# EAGLE design kreme-iss (EAGLE 9.6.2)

## Sheet 1 of 4
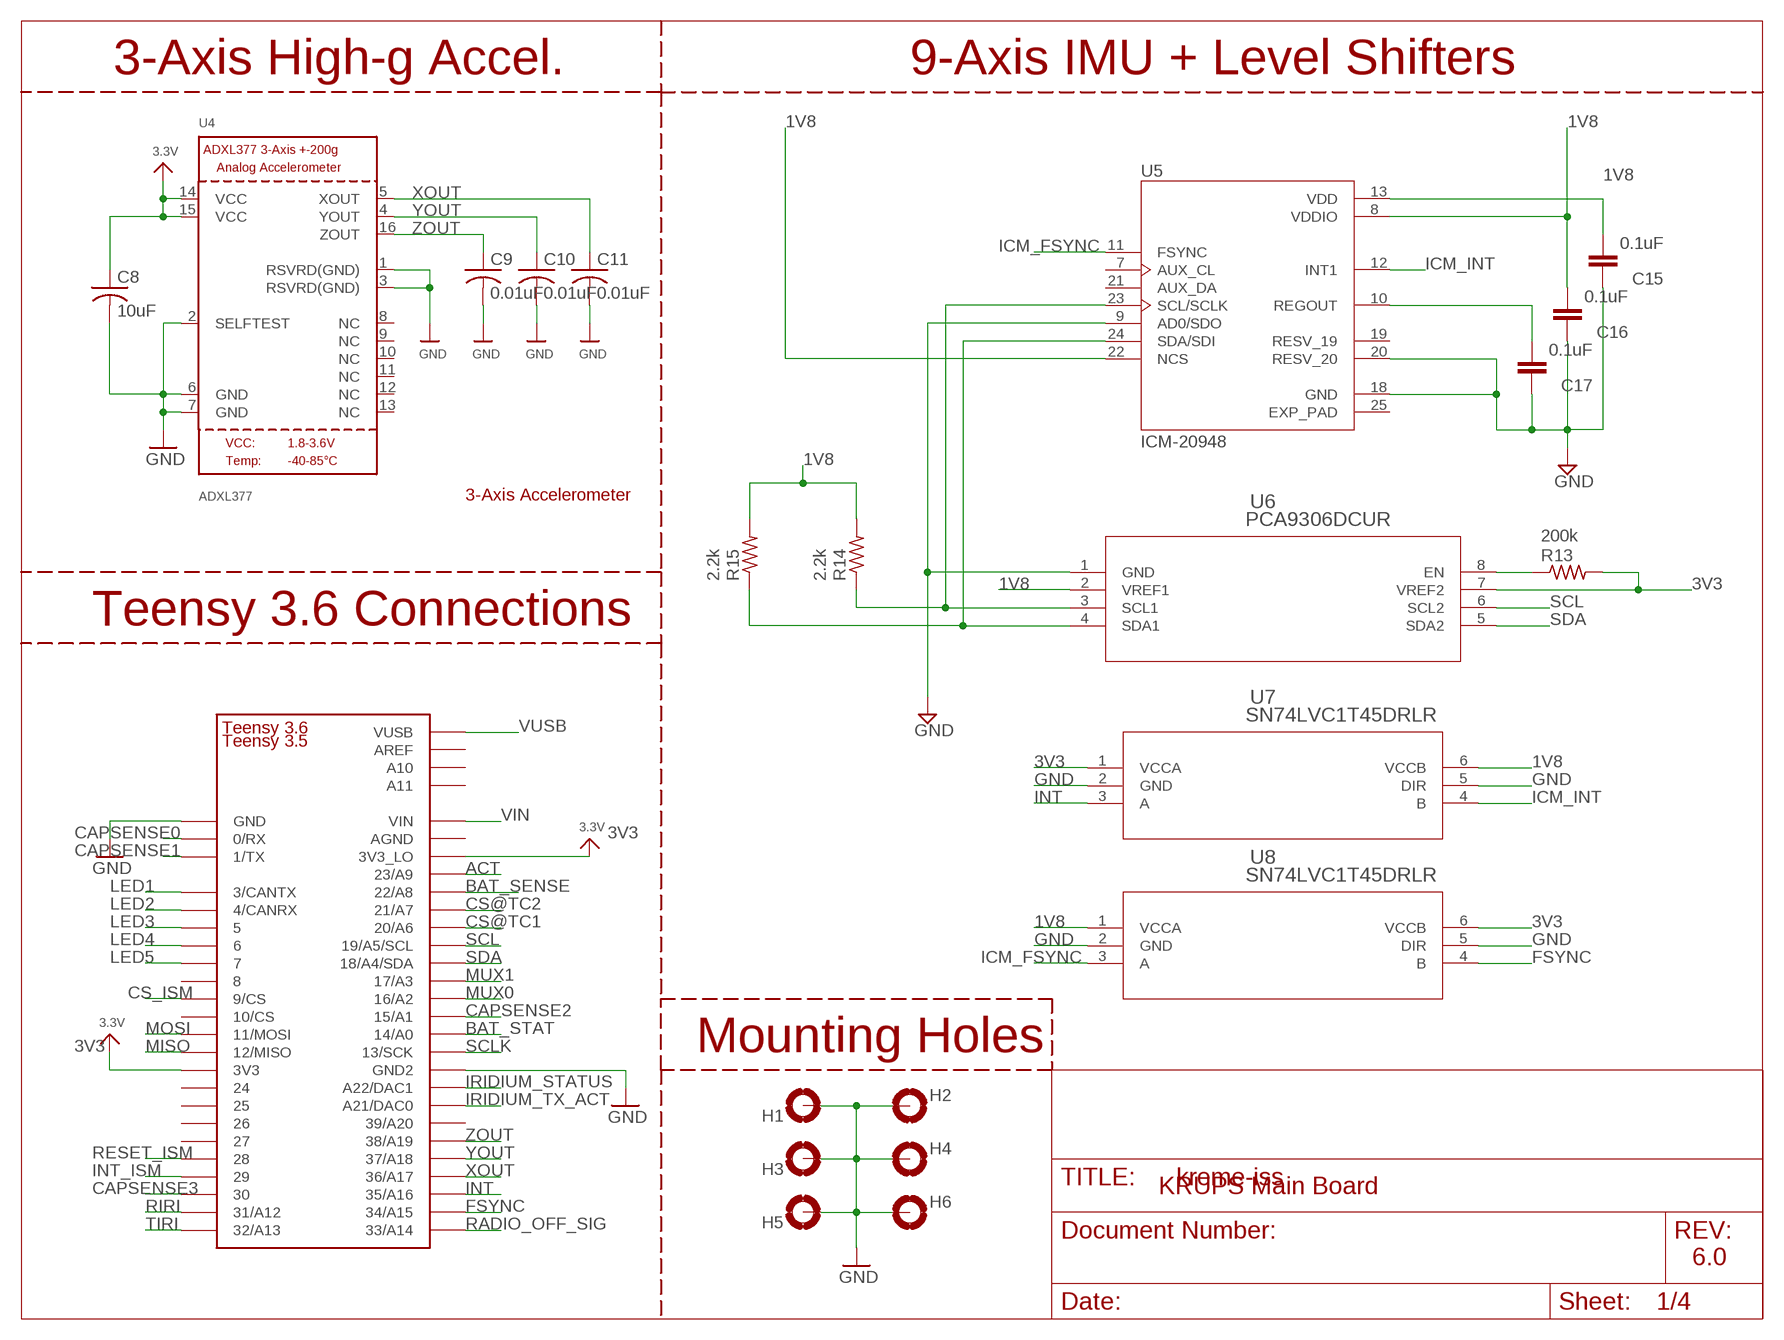
[diagram p0: schematic, sheet 1]

### Parts
C8  10uF  C-USC0603  [C0603]
C9  0.01uF  C-USC0603  [C0603]
C10  0.01uF  C-USC0603  [C0603]
C11  0.01uF  C-USC0603  [C0603]
C15  0.1uF  C-EUC0603  [C0603]
C16  0.1uF  C-EUC0603  [C0603]
C17  0.1uF  C-EUC0603  [C0603]
H1  MOUNT-PAD-ROUND2.8  [2,8-PAD]
H2  MOUNT-PAD-ROUND2.8  [2,8-PAD]
H3  MOUNT-PAD-ROUND2.8  [2,8-PAD]
H4  MOUNT-PAD-ROUND2.8  [2,8-PAD]
H5  MOUNT-PAD-ROUND2.8  [2,8-PAD]
H6  MOUNT-PAD-ROUND2.8  [2,8-PAD]
R13  200k  R-US_R0603  [R0603]
R14  2.2k  R-US_R0603  [R0603]
R15  2.2k  R-US_R0603  [R0603]
U4  ADXL377  ACCEL_ADXL377  [LFCSP16_LQ]
U5  ICM-20948  [QFN40P300X300X105-25N]
U6  PCA9306DCUR  [DCU8]
U7  SN74LVC1T45DRLR  [DRL6]
U8  SN74LVC1T45DRLR  [DRL6]
U$1  TEENSY_3.5/3.6_BASIC  [TEENSY_3.5/3.6_BASIC]

### Nets
1V8: C15.2 C16.2 R14.2 R15.2 U5.8(VDDIO) U5.13(VDD) U5.22(NCS) U6.2(VREF1) U7.6(VCCB) U8.1(VCCA) ; also sheet 3
3V3: C8.1 R13.2 U4.14(VCC) U4.15(VCC) U6.7(VREF2) U7.1(VCCA) U8.6(VCCB) U$1.3V3 U$1.3V3_LO ; supply symbol labelled 3.3V ; also sheet 2,3
ACT: U$1.23/A9 ; also sheet 3
BAT_SENSE: U$1.22/A8 ; also sheet 3
BAT_STAT: U$1.14/A0 ; also sheet 3
CAPSENSE0: U$1.0/RX ; also sheet 4
CAPSENSE1: U$1.1/TX ; also sheet 4
CAPSENSE2: U$1.15/A1 ; also sheet 4
CAPSENSE3: U$1.30 ; also sheet 4
CS@TC1: U$1.20/A6 ; also sheet 2
CS@TC2: U$1.21/A7 ; also sheet 2
CS_ISM: U$1.9/CS ; also sheet 4
FSYNC: U8.4(B) U$1.34/A15
GND: C8.2 C9.2 C10.2 C11.2 C15.1 C16.1 C17.1 H1.B2,8(MOUNT) H2.B2,8(MOUNT) H3.B2,8(MOUNT) H4.B2,8(MOUNT) H5.B2,8(MOUNT) H6.B2,8(MOUNT) U4.1(RSVRD(GND)) U4.2(SELFTEST) U4.3(RSVRD(GND)) U4.6(GND) U4.7(GND) U5.9(AD0/SDO) U5.18(GND) U5.20(RESV_20) U6.1(GND) U7.2(GND) U7.5(DIR) U8.2(GND) U8.5(DIR) U$1.GND ; also sheet 2,3,4
ICM_FSYNC: U5.11(FSYNC) U8.3(A)
ICM_INT: U5.12(INT1) U7.4(B)
INT: U7.3(A) U$1.35/A16
INT_ISM: U$1.29 ; also sheet 4
IRIDIUM_STATUS: U$1.A22/DAC1 ; also sheet 3
IRIDIUM_TX_ACT: U$1.21/DAC0(A21/DAC0) ; also sheet 3
LED1: U$1.3/CANTX ; also sheet 4
LED2: U$1.4/CANRX ; also sheet 4
LED3: U$1.5 ; also sheet 4
LED4: U$1.6 ; also sheet 4
LED5: U$1.7 ; also sheet 4
MISO: U$1.12/MISO ; also sheet 2,4
MOSI: U$1.11/MOSI ; also sheet 2,4
MUX0: U$1.16/A2 ; also sheet 2
MUX1: U$1.17/A3 ; also sheet 2
N$1: U$1.GND2 ; supply symbol labelled GND
N$13: R13.1 U6.8(EN)
N$15: C17.2 U5.10(REGOUT)
N$18: R14.1 U5.23(SCL/SCLK) U6.3(SCL1)
N$19: R15.1 U5.24(SDA/SDI) U6.4(SDA1)
RADIO_OFF_SIG: U$1.33/A14 ; also sheet 3
RESET_ISM: U$1.28 ; also sheet 4
RIRI: U$1.31/A12 ; also sheet 3
SCL: U6.6(SCL2) U$1.19/A5/SCL
SCLK: U$1.13/SCK ; also sheet 2,4
SDA: U6.5(SDA2) U$1.18/A4/SDA
TIRI: U$1.32/A13 ; also sheet 3
VIN: U$1.VIN ; also sheet 3
VUSB: U$1.VUSB ; also sheet 3
XOUT: C11.1 U4.5(XOUT) U$1.36/A17
YOUT: C10.1 U4.4(YOUT) U$1.37/A18
ZOUT: C9.1 U4.16(ZOUT) U$1.38/A19
Unconnected: U4.8(NC) U4.9(NC) U4.10(NC) U4.11(NC) U4.12(NC) U4.13(NC) U5.7(AUX_CL) U5.19(RESV_19) U5.21(AUX_DA) U$1.8 U$1.10/CS U$1.24 U$1.25 U$1.26 U$1.27 U$1.39/A20 U$1.A10 U$1.A11 U$1.AGND U$1.AREF

### Notes on the sheet
- 3-Axis High-g Accel. | 9-Axis IMU + Level Shifters
- 3-Axis Accelerometer
- Teensy 3.6 Connections
- Teensy 3.5
- Mounting Holes
- KRUPS Main Board
- 6.0

## Sheet 2 of 4
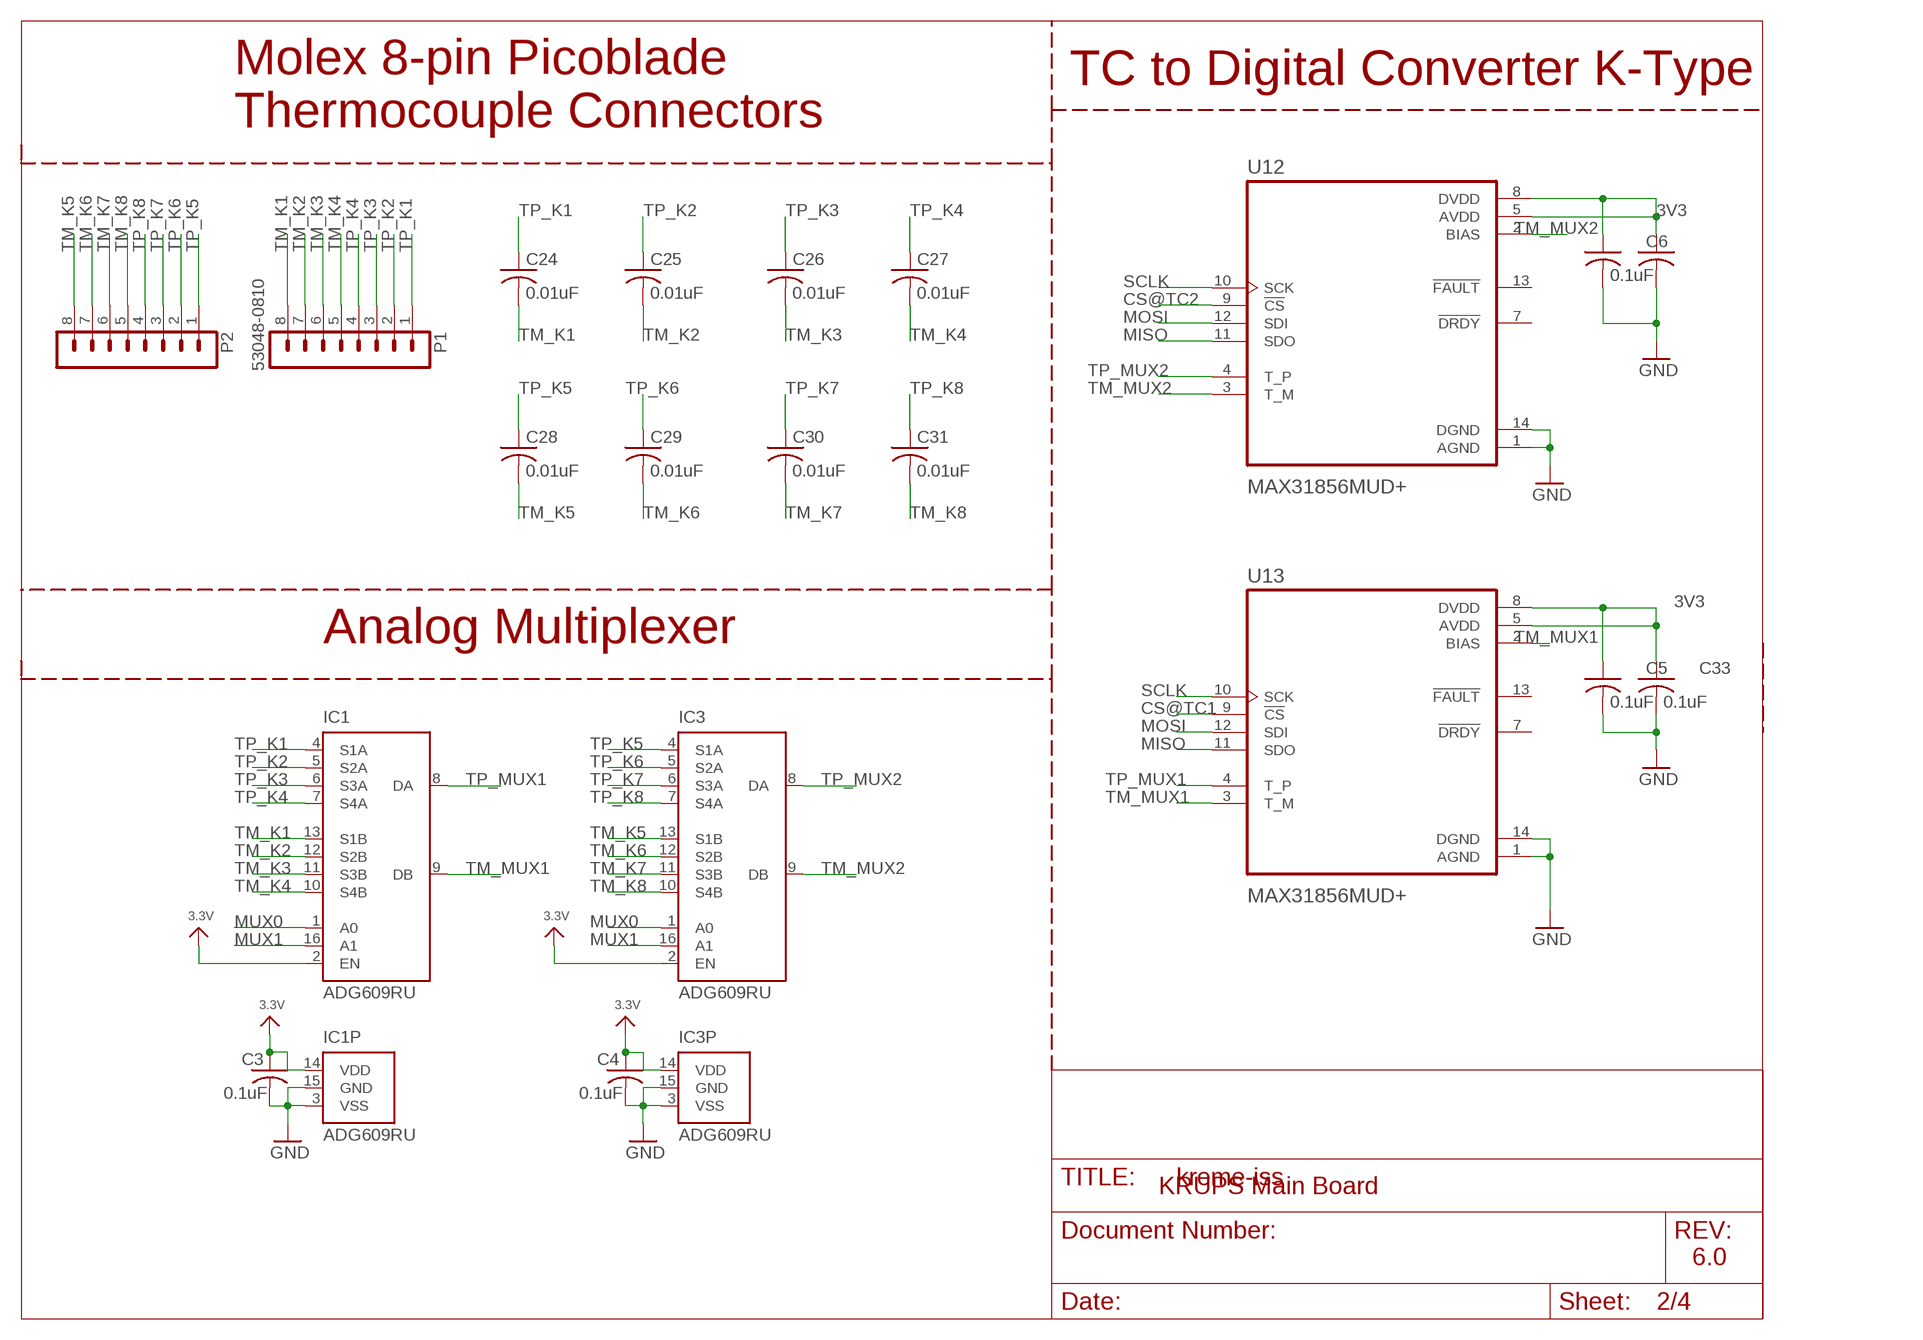
[diagram p1: schematic, sheet 2]

### Parts
C3  0.1uF  C-USC0603  [C0603]
C4  0.1uF  C-USC0603  [C0603]
C5  0.1uF  C-USC0603  [C0603]
C6  0.1uF  C-USC0603  [C0603]
C24  0.01uF  C-USC0603  [C0603]
C25  0.01uF  C-USC0603  [C0603]
C26  0.01uF  C-USC0603  [C0603]
C27  0.01uF  C-USC0603  [C0603]
C28  0.01uF  C-USC0603  [C0603]
C29  0.01uF  C-USC0603  [C0603]
C30  0.01uF  C-USC0603  [C0603]
C31  0.01uF  C-USC0603  [C0603]
C32  0.1uF  C-USC0603  [C0603]
C33  0.1uF  C-USC0603  [C0603]
IC1  ADG609RU  [TSSOP16]
IC3  ADG609RU  [TSSOP16]
P1  53048-0810  [53048-0810]
P2  53048-0810  [53048-0810]
U12  MAX31856MUD+  [SOP65P640X110-14N]
U13  MAX31856MUD+  [SOP65P640X110-14N]

### Nets
3V3: C3.1 C4.1 C5.1 C6.1 C32.1 C33.1 IC1.2(EN) IC1.14(VDD) IC3.2(EN) IC3.14(VDD) U12.5(AVDD) U12.8(DVDD) U13.5(AVDD) U13.8(DVDD) ; supply symbol labelled 3.3V ; also sheet 1,3
CS@TC1: U13.9(!CS) ; also sheet 1
CS@TC2: U12.9(!CS) ; also sheet 1
GND: C3.2 C4.2 C5.2 C6.2 C32.2 C33.2 IC1.3(VSS) IC1.15(GND) IC3.3(VSS) IC3.15(GND) U12.1(AGND) U12.14(DGND) U13.1(AGND) U13.14(DGND) ; also sheet 1,3,4
MISO: U12.11(SDO) U13.11(SDO) ; also sheet 1,4
MOSI: U12.12(SDI) U13.12(SDI) ; also sheet 1,4
MUX0: IC1.1(A0) IC3.1(A0) ; also sheet 1
MUX1: IC1.16(A1) IC3.16(A1) ; also sheet 1
SCLK: U12.10(SCK) U13.10(SCK) ; also sheet 1,4
TM_K1: C24.2 IC1.13(S1B) P1.8
TM_K2: C25.2 IC1.12(S2B) P1.7
TM_K3: C26.2 IC1.11(S3B) P1.6
TM_K4: C27.2 IC1.10(S4B) P1.5
TM_K5: C28.2 IC3.13(S1B) P2.8
TM_K6: C29.2 IC3.12(S2B) P2.7
TM_K7: C30.2 IC3.11(S3B) P2.6
TM_K8: C31.2 IC3.10(S4B) P2.5
TM_MUX1: IC1.9(DB) U13.2(BIAS) U13.3(T_M)
TM_MUX2: IC3.9(DB) U12.2(BIAS) U12.3(T_M)
TP_K1: C24.1 IC1.4(S1A) P1.1
TP_K2: C25.1 IC1.5(S2A) P1.2
TP_K3: C26.1 IC1.6(S3A) P1.3
TP_K4: C27.1 IC1.7(S4A) P1.4
TP_K5: C28.1 IC3.4(S1A) P2.1
TP_K6: C29.1 IC3.5(S2A) P2.2
TP_K7: C30.1 IC3.6(S3A) P2.3
TP_K8: C31.1 IC3.7(S4A) P2.4
TP_MUX1: IC1.8(DA) U13.4(T_P)
TP_MUX2: IC3.8(DA) U12.4(T_P)
Unconnected: U12.7(!DRDY) U12.13(!FAULT) U13.7(!DRDY) U13.13(!FAULT)

### Notes on the sheet
- TC to Digital Converter K-Type
- Molex 8-pin Picoblade
  Thermocouple Connectors
- Analog Multiplexer
- KRUPS Main Board
- 6.0

## Sheet 3 of 4
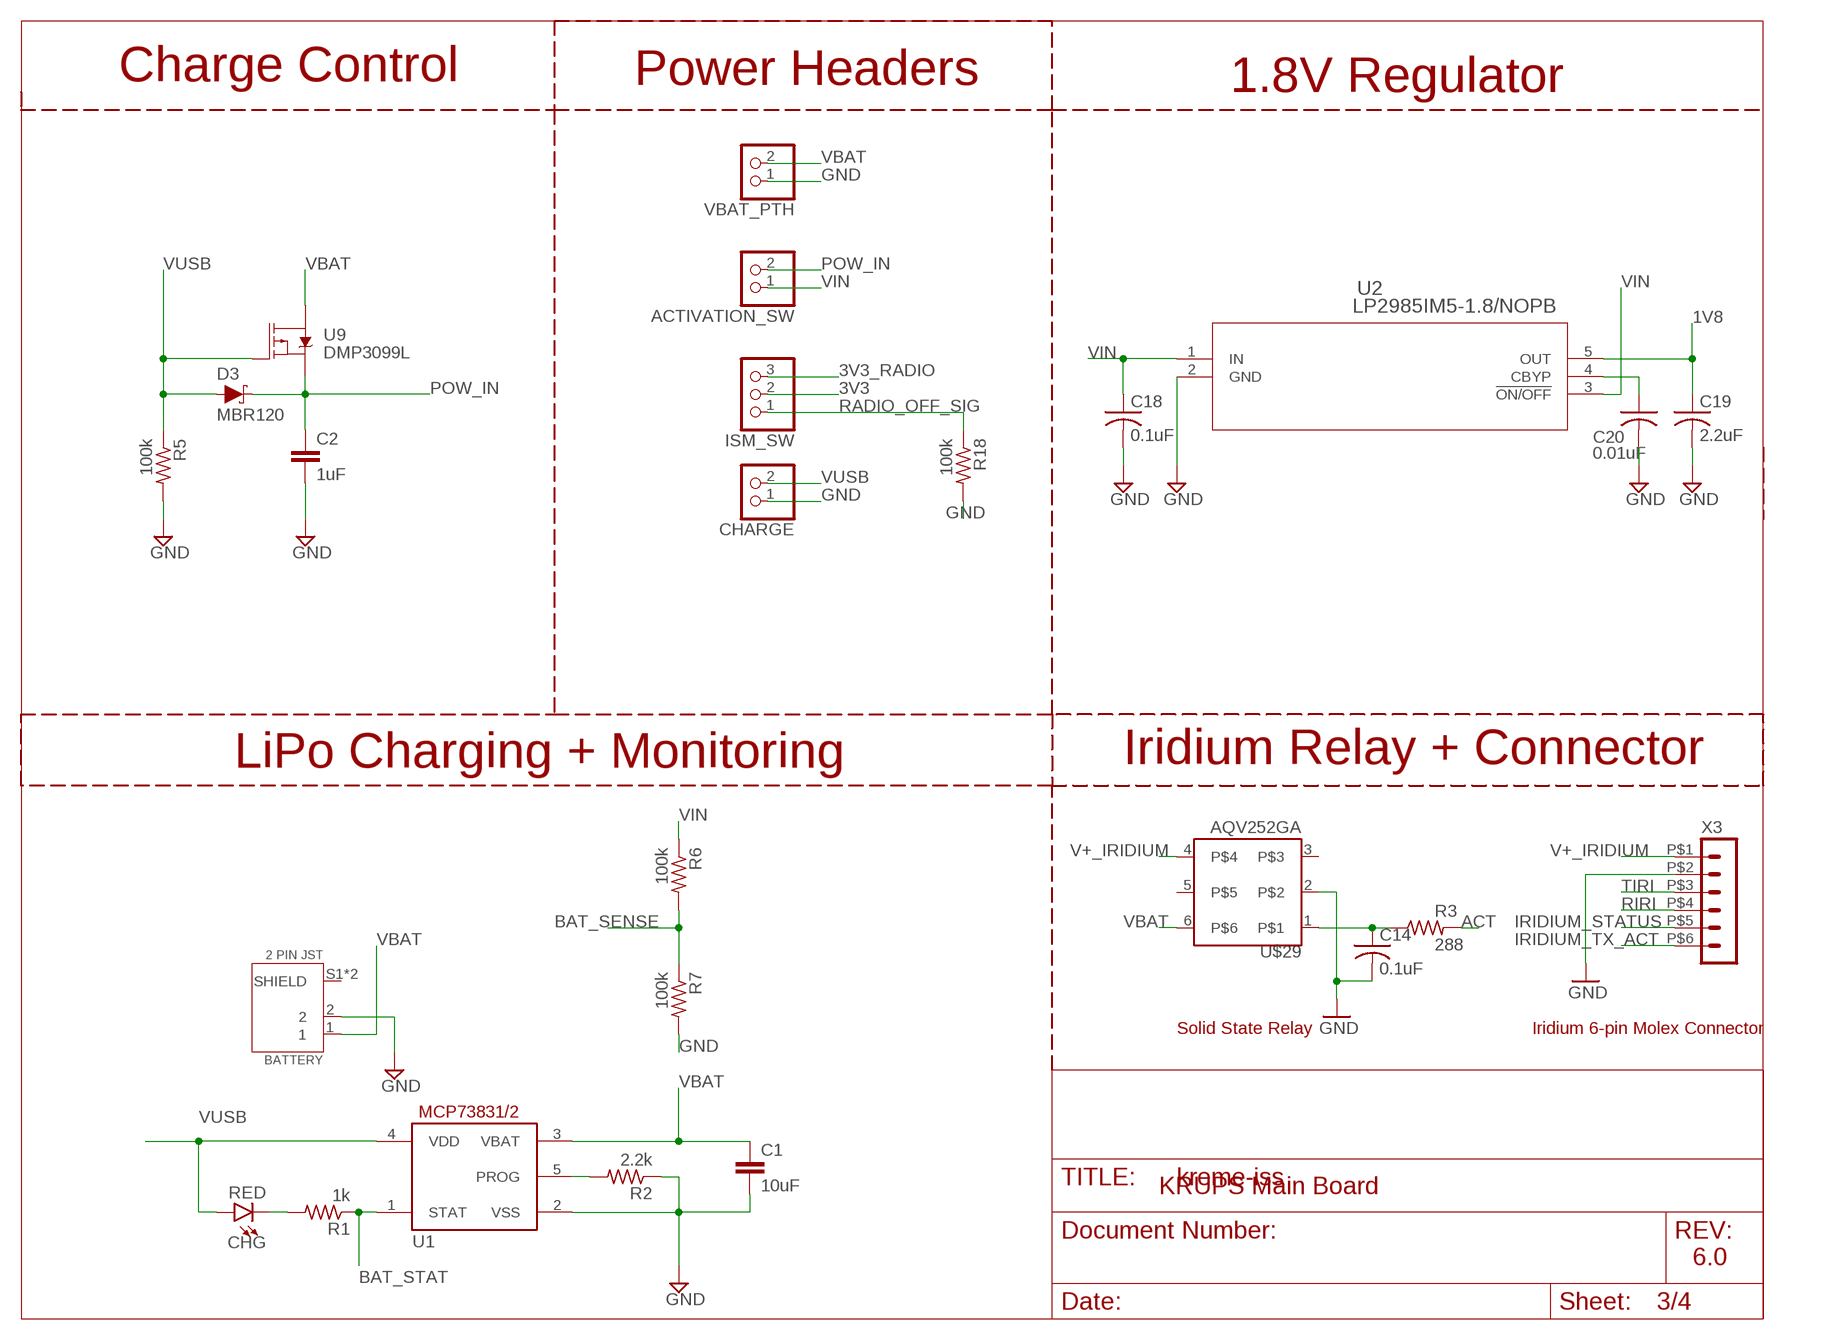
[diagram p2: schematic, sheet 3]

### Parts
ACTIVATION_SW  PINHD-1X2  [1X02]
BATTERY  2 PIN JST  S2B-PH-SM4-TB(LF)(SN)  [JST_S2B-PH-SM4-TB(LF)(SN)]
C1  10uF  C-EUC0603  [C0603]
C2  1uF  C-EUC0603  [C0603]
C14  0.1uF  C-USC0603  [C0603]
C18  0.1uF  C-USC0603  [C0603]
C19  2.2uF  C-USC0603  [C0603]
C20  0.01uF  C-USC0603  [C0603]
CHARGE  PINHD-1X2  [1X02]
CHG  RED  LED-RED0603  [LED-0603]
D3  MBR120  [SOD123FL]
ISM_SW  PINHD-1X3CB  [1X03-CLEANBIG]
R1  1k  R-US_R0603  [R0603]
R2  2.2k  R-US_R0603  [R0603]
R3  288  R-US_R0603  [R0603]
R5  100k  R-US_R0603  [R0603]
R6  100k  R-US_R0603  [R0603]
R7  100k  R-US_R0603  [R0603]
R18  100k  R-US_R0603  [R0603]
U1  MCP73831/OT  [SOT23-5L]
U2  LP2985IM5-1.8/NOPB  [MF05A]
U9  DMP3099L  [SOT23]
U$29  AQV252GA  [DIP6]
VBAT_PTH  PINHD-1X2  [1X02]
X3  HEADER_POS6_43650-0600  [43650-0600]

### Nets
1V8: C19.1 U2.5(OUT) ; also sheet 1
3V3: ISM_SW.2 ; also sheet 1,2
3V3_RADIO: ISM_SW.3 ; also sheet 4
ACT: R3.2 ; also sheet 1
BAT_SENSE: R6.2 R7.1 ; also sheet 1
BAT_STAT: R1.1 U1.1(STAT) ; also sheet 1
GND: BATTERY.2 C1.2 C2.2 C14.2 C18.2 C19.2 C20.2 CHARGE.1 R2.1 R5.2 R7.2 R18.2 U1.2(VSS) U2.2(GND) U$29.2 VBAT_PTH.1 X3.P$2 ; also sheet 1,2,4
IRIDIUM_STATUS: X3.P$5 ; also sheet 1
IRIDIUM_TX_ACT: X3.P$6 ; also sheet 1
N$4: R2.2 U1.5(PROG)
N$6: C14.1 R3.1 U$29.1
N$9: CHG.C R1.2
N$12: C20.1 U2.4(CBYP)
POW_IN: ACTIVATION_SW.2 C2.1 D3.C U9.2(S)
RADIO_OFF_SIG: ISM_SW.1 R18.1 ; also sheet 1
RIRI: X3.P$4 ; also sheet 1
TIRI: X3.P$3 ; also sheet 1
V+_IRIDIUM: U$29.4 X3.P$1
VBAT: BATTERY.1 C1.1 U1.3(VBAT) U9.3(D) U$29.6 VBAT_PTH.2
VIN: ACTIVATION_SW.1 C18.1 R6.1 U2.1(IN) U2.3(!ON/OFF) ; also sheet 1
VUSB: CHARGE.2 CHG.A D3.A R5.1 U1.4(VDD) U9.1(G) ; also sheet 1
Unconnected: BATTERY.S1(SHIELD) BATTERY.S2(SHIELD) U$29.3 U$29.5

### Notes on the sheet
- Charge Control | Power Headers | 1.8V Regulator
- LiPo Charging + Monitoring | Iridium Relay + Connector
- Solid State Relay | Iridium 6-pin Molex Connector
- KRUPS Main Board
- 6.0

## Sheet 4 of 4
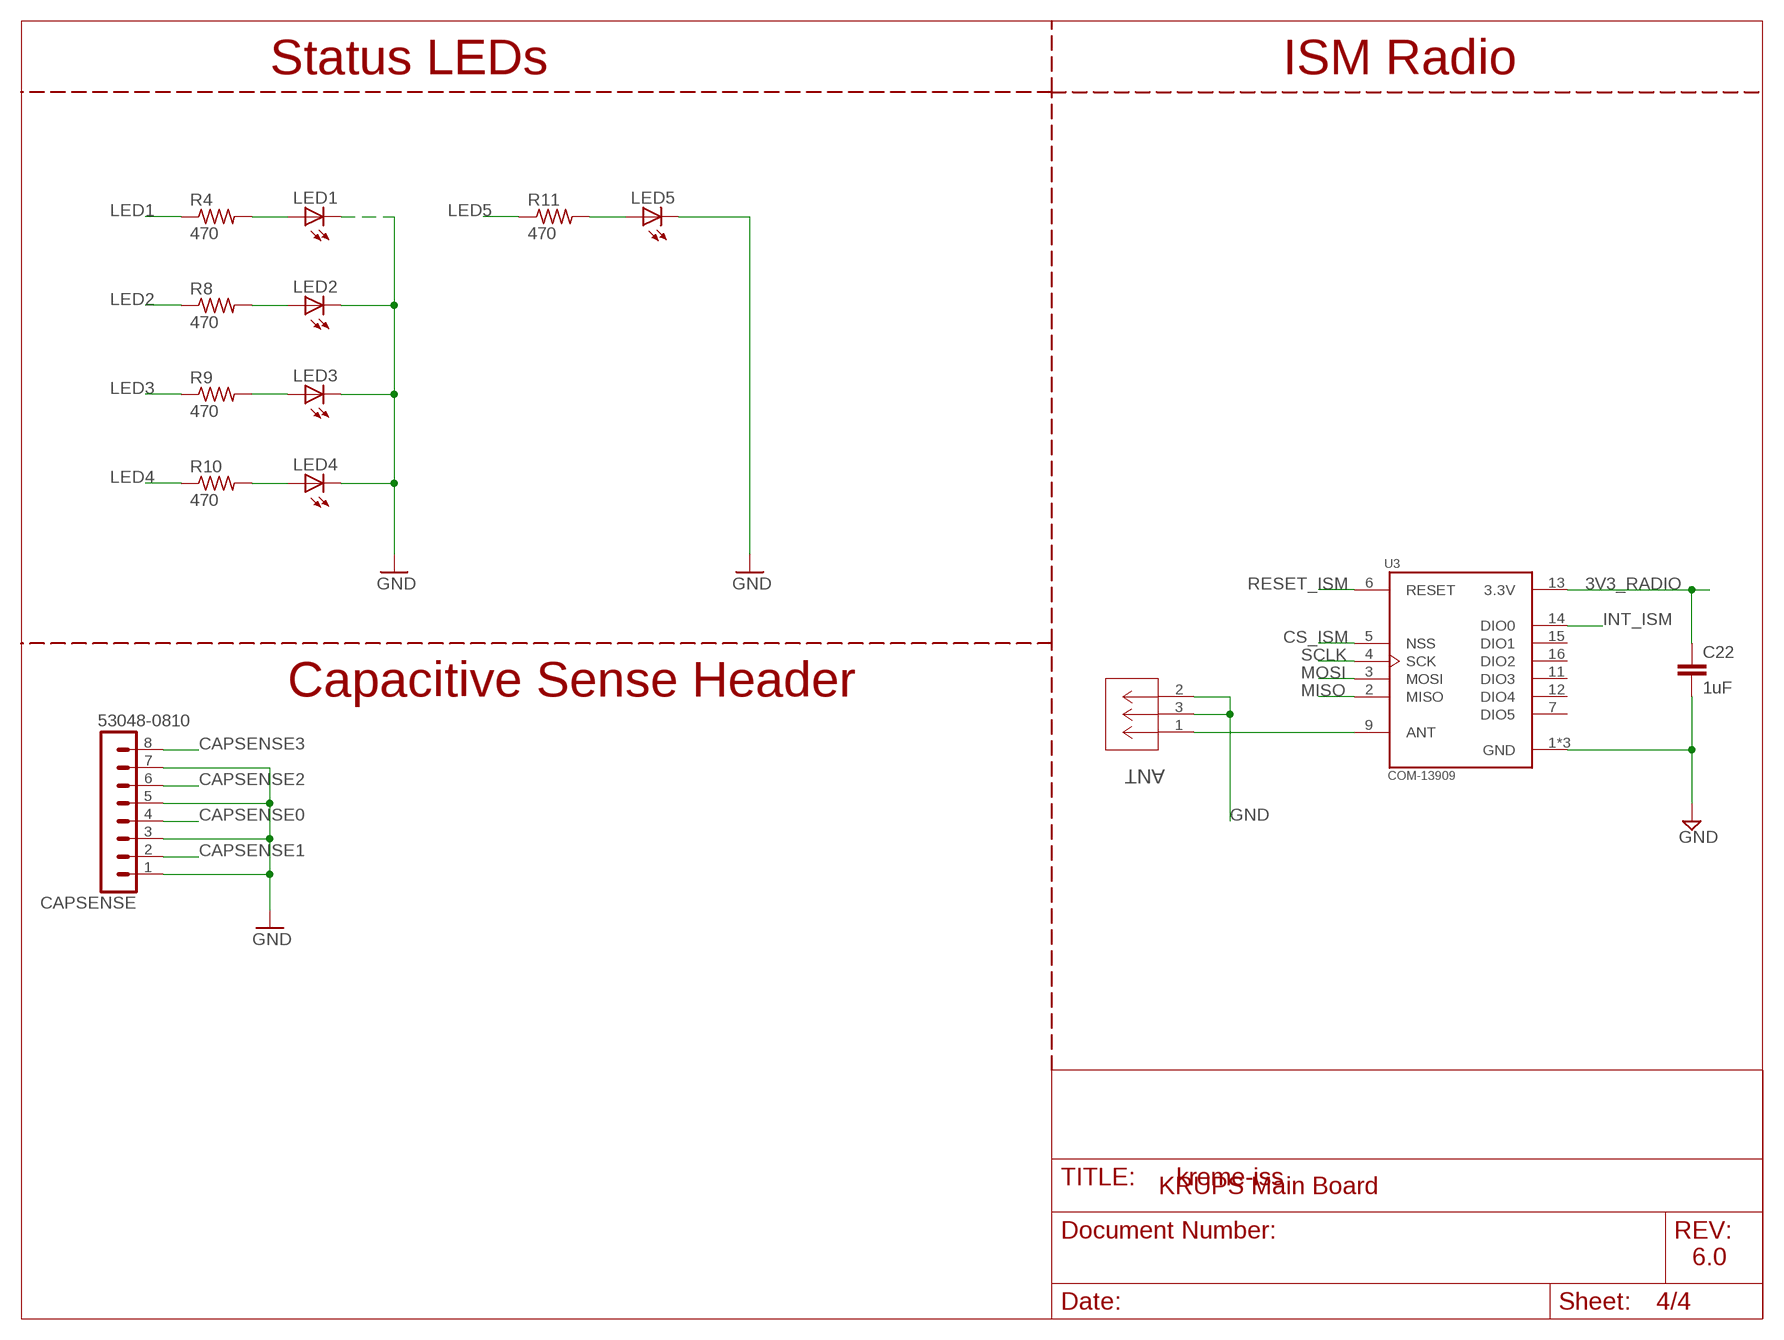
[diagram p3: schematic, sheet 4]

### Parts
ANT  U.FL-R-SMT-1(10)  [CONN_R-SMT-1(10)]
C22  1uF  C-EUC0603  [C0603]
CAPSENSE  53048-0810  [53048-0810]
LED1  LEDCHIP-LED0603  [CHIP-LED0603]
LED2  LEDCHIP-LED0603  [CHIP-LED0603]
LED3  LEDCHIP-LED0603  [CHIP-LED0603]
LED4  LEDCHIP-LED0603  [CHIP-LED0603]
LED5  LEDCHIP-LED0603  [CHIP-LED0603]
R4  470  R-US_R0603  [R0603]
R8  470  R-US_R0603  [R0603]
R9  470  R-US_R0603  [R0603]
R10  470  R-US_R0603  [R0603]
R11  470  R-US_R0603  [R0603]
U3  COM-13909  [MOD_COM-13909]

### Nets
3V3_RADIO: C22.1 U3.13(3.3V) ; also sheet 3
CAPSENSE0: CAPSENSE.4 ; also sheet 1
CAPSENSE1: CAPSENSE.2 ; also sheet 1
CAPSENSE2: CAPSENSE.6 ; also sheet 1
CAPSENSE3: CAPSENSE.8 ; also sheet 1
CS_ISM: U3.5(NSS) ; also sheet 1
GND: ANT.2 ANT.3 C22.2 CAPSENSE.1 CAPSENSE.3 CAPSENSE.5 CAPSENSE.7 LED1.C LED2.C LED3.C LED4.C LED5.C U3.1(GND) U3.8(GND) U3.10(GND) ; also sheet 1,2,3
INT_ISM: U3.14(DIO0) ; also sheet 1
LED1: R4.1 ; also sheet 1
LED2: R8.1 ; also sheet 1
LED3: R9.1 ; also sheet 1
LED4: R10.1 ; also sheet 1
LED5: R11.1 ; also sheet 1
MISO: U3.2(MISO) ; also sheet 1,2
MOSI: U3.3(MOSI) ; also sheet 1,2
N$3: ANT.1 U3.9(ANT)
N$20: LED1.A R4.2
N$21: LED2.A R8.2
N$22: LED3.A R9.2
N$23: LED4.A R10.2
N$28: LED5.A R11.2
RESET_ISM: U3.6(RESET) ; also sheet 1
SCLK: U3.4(SCK) ; also sheet 1,2
Unconnected: U3.7(DIO5) U3.11(DIO3) U3.12(DIO4) U3.15(DIO1) U3.16(DIO2)

### Notes on the sheet
- Status LEDs | ISM Radio
- Capacitive Sense Header
- KRUPS Main Board
- 6.0

## Power pins joined to a net without a drawn wire
EXP_PAD: U5.25(EXP_PAD)

## Library data of the parts
ACTIVATION_SW CHARGE VBAT_PTH = pinhead:PINHD-1X2: PIN HEADER
ANT = ufl:U.FL-R-SMT-1(10); BUILT_BY: EMA_Matt; COPYRIGHT: Copyright (C) 2018 Accelerated Designs. All rights reserved; MANUFACTURER_PART_NUMBER: U.FL-R-SMT-1(10); VENDOR: Hirose
BATTERY = S2B-PH-SM4-TB_LF__SN_:S2B-PH-SM4-TB(LF)(SN): PH Series 2 Position 2 mm Pitch Surface Mount Side Entry Shrouded Header; DESCRIPTION: PH Series 2 Position 2 mm Pitch Surface Mount Side Entry Shrouded Header; DIGI-KEY_PART_NUMBER: 455-1749-1-ND; DIGI-KEY_PURCHASE_URL: https://www.digikey.com/product-detail/en/jst-sales-america-inc/S2B-PH-SM4-TB_LF__SN_/455-1749-1-ND/926846?utm_source=snapeda&utm_medium=aggregator&utm_campaign=symbol; MF: JST Sales; MP: S2B-PH-SM4-TB_LF__SN_; PACKAGE: FakePackage u
C1 C2 C15-C17 C22 = rcl:C-EU: CAPACITOR, European symbol; SPICEPREFIX: C
C3-C6 C8-C11 C14 C24-C33 = adafruit:C-US: CAPACITOR, American symbol
C18-C20 = rcl:C-US: CAPACITOR, American symbol; SPICEPREFIX: C
CAPSENSE P1 P2 = con-molex-picoblade:53048-0810: HEADER
CHG = SparkFun-LED:LED-RED: Red SMD LED Used in manufacturing of most products at SparkFun Packages: 0603 - SMD 0603 package [Product Link] <http://docs.avagotech.com/docs/AV02-0551EN> 0603 SMART - SMD 0603 SMART package ( more efficient and expensive)[Product Link] <http://www.osram-os.com/Graphics/XPic2/00077099_0.pdf> 1206 - SMD1206 package [Product Link] <https://www.sparkfun.com/datasheets/DevTools/LilyPad/Q150OVS4.pdff> SparkFun Products: Pro Mini 328 -5V <https://www.sparkfun.com/products/821> RedBoard <https://www.sparkfun.com/products/12757> IOIO-OTG <https://www.sparkfun.com/products/13613>; PROD_ID: DIO-00819
D3 = gsynth:MBR120: Diode Schottky 20V 1A Surface Mount SOD-123FL
H1-H6 = holes:MOUNT-PAD-ROUND: MOUNTING PAD, round
IC1 IC3 = analog-devices:ADG609: 3 V/5 V, 4 Channel High Performance Analog Multiplexers Source: ADG608_609.pdf; MPN: ADG609BRUZ; OC_FARNELL: 1438945; OC_NEWARK: 19M8664
ISM_SW = adafruit:PINHD-1X3: PIN HEADER
LED1-LED5 = adafruit:LED: LED OSRAM: - CHIPLED LG R971, LG N971, LY N971, LG Q971, LY Q971, LO R971, LY R971 LH N974, LH R974 LS Q976, LO Q976, LY Q976 LO Q996 - Hyper CHIPLED LW Q18S LB Q993, LB Q99A, LB R99A - SideLED LS A670, LO A670, LY A670, LG A670, LP A670 LB A673, LV A673, LT A673, LW A673 LH A674 LY A675 LS A676, LA A676, LO A676, LY A676, LW A676 LS A679, LY A679, LG A679 - Hyper Micro SIDELED® LS Y876, LA Y876, LO Y876, LY Y876 LT Y87S - SmartLED LW L88C, LW L88S LB L89C, LB L89S, LG L890 LS L89K, LO L89K, LY L89K LS L896, LA L896, LO L896, LY L896 - TOPLED LS T670, LO T670, LY T670, LG T670, LP T670 LSG T670, LSP T670, LSY T670, LOP T670, LYG T670 LG T671, LOG T671, LSG T671 LB T673, LV T673, LT T673, LW T673 LH T674 LS T676, LA T676, LO T676, LY T676, LB T676, LH T676, LSB T676, LW T676 LB T67C, LV T67C, LT T67C, LS T67K, LO T67K, LY T67K, LW E67C LS E67B, LA E67B, LO E67B, LY E67B, LB E67C, LV E67C, LT E67C LW T67C LS T679, LY T679, LG T679 LS T770, LO T770, LY T770, LG T770, LP T770 LB T773, LV T773, LT T773, LW T773 LH T774 LS E675, LA E675, LY E675, LS T675 LS T776, LA T776, LO T776, LY T776, LB T776 LHGB T686 LT T68C, LB T68C - Hyper Mini TOPLED® LB M676 - Mini TOPLED Santana® LG M470 LS M47K, LO M47K, LY M47K Source: http://www.osram.convergy.de/
R1 R2 R4-R11 R13-R15 R18 = rcl:R-US_: RESISTOR, American symbol; SPICEPREFIX: R
R3 = adafruit:R-US_: RESISTOR, American symbol
U1 = adafruit:MCP73831: MCP73831/2 Miniature Single-Cell, Fully Integrated Li-Ion, Li-Polymer Charge Management Controllers. Nice and small simple lipoly charge controller, with adjustable current and status output (LED) http://www.ladyada.net/library/pcb/eaglelibrary.html
U2 = gsynth:LP2985IM5-1.8/NOPB; MANUFACTURER_PART_NUMBER: LP2985IM51.8NOPB; VENDOR: Texas Instruments
U3 = COM-13909:COM-13909: Rfm69hcw Wireless Transceiver 91; DESCRIPTION: General ISM < 1GHz Transceiver Module 915MHz Surface Mount; DIGI-KEY_PART_NUMBER: 1568-1394-ND; DIGI-KEY_PURCHASE_URL: https://www.digikey.com/product-detail/en/sparkfun-electronics/COM-13909/1568-1394-ND/6023504?utm_source=snapeda&utm_medium=aggregator&utm_campaign=symbol; MF: SparkFun Electronics; MP: COM-13909; PACKAGE: Module SparkFun Electronics
U4 = microbuilder:ACCEL_ADXL377: ADXL377 +/-200g 3-Axis Analog Accelerometer VCC: 1.8-3.6V
U5 = ICM-20948:ICM-20948: Axis=3 Axis Gyro+3 Axis Accel+Compass. Pin For Pin With m; DESCRIPTION: 9 Axis=3 Axis Gyro+3 Axis Accel+Compass. Pin For Pin With m; DIGI-KEY_PART_NUMBER: 1428-1123-1-ND; DIGI-KEY_PURCHASE_URL: https://www.digikey.com/product-detail/en/tdk-invensense/ICM-20948/1428-1123-1-ND/7062698?utm_source=snapeda&utm_medium=aggregator&utm_campaign=symbol; MF: TDK InvenSense; MP: ICM-20948; PACKAGE: QFN-24 InvenSense
U6 = gsynth:PCA9306DCUR; MANUFACTURER_PART_NUMBER: PCA9306DCUR; VENDOR: Texas Instruments
U7 U8 = gsynth:SN74LVC1T45DRLR; MANUFACTURER_PART_NUMBER: SN74LVC1T45DRLR; VENDOR: Texas Instruments
U9 = gsynth:DMP3099L: P-Channel 30V 3.8A (Ta) 1.08W (Ta) Surface Mount SOT-23
U12 U13 = MAX31856:MAX31856MUD+: None; DESCRIPTION: IC CONV THERMOCOUPLE 14TSSOP; DIGI-KEY_PART_NUMBER: MAX31856MUD+TTR-ND; MF: Maxim Integrated; MP: MAX31856MUD+; PACKAGE: TSSOP-14 Maxim
U$1 = Teensy356:TEENSY_3.5/3.6_BASIC
U$29 = TI_radio:AQV252GA
X3 = con-molex-micro-fit-3_0:HEADER_POS6_?: Molex - Micro-Fit 3.0 Series connector, 3.00mm (0.118") pitch header, 6 positions.

## Board
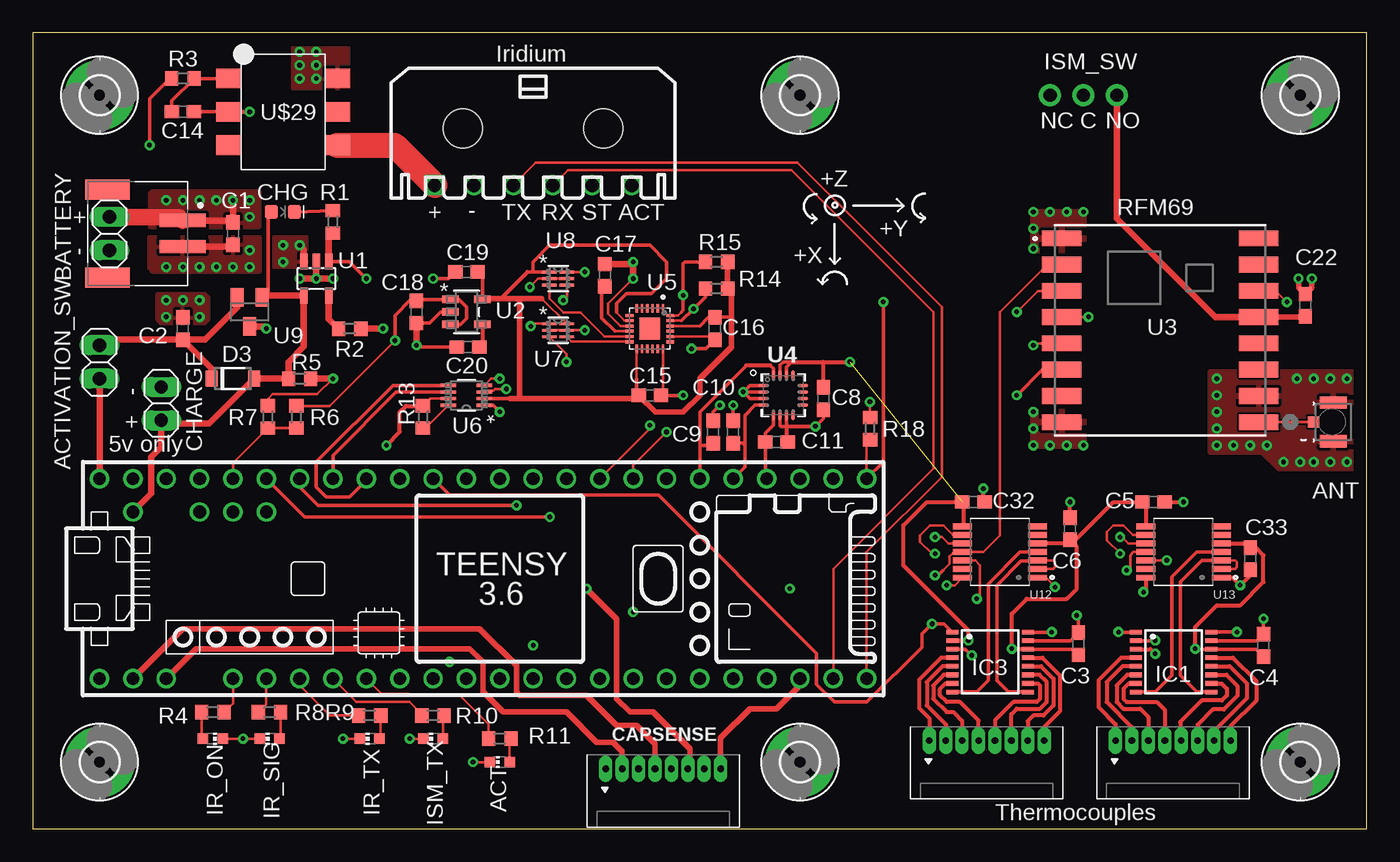
[diagram p4: board, top side]
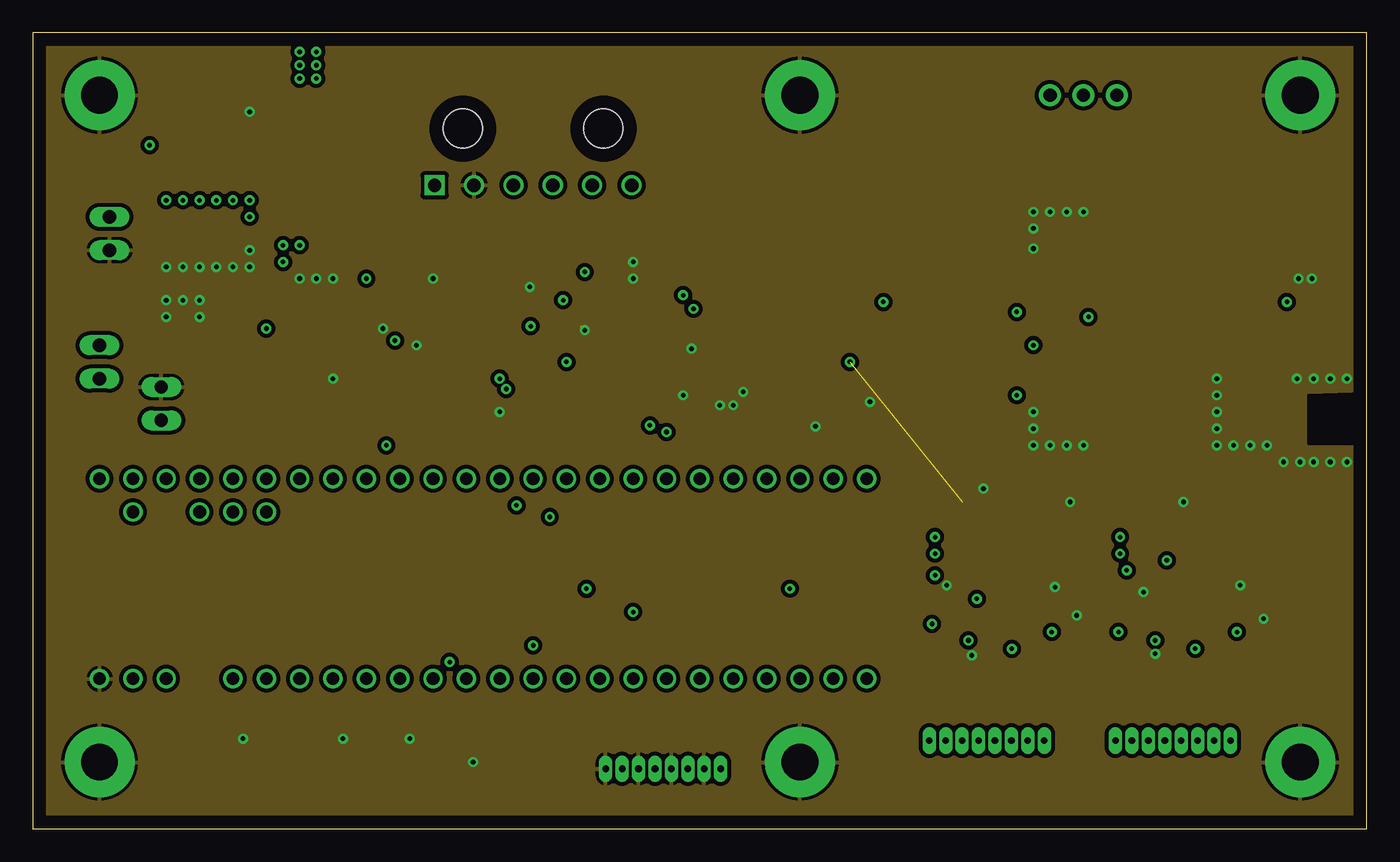
[diagram p5: board, inner layer Route2]
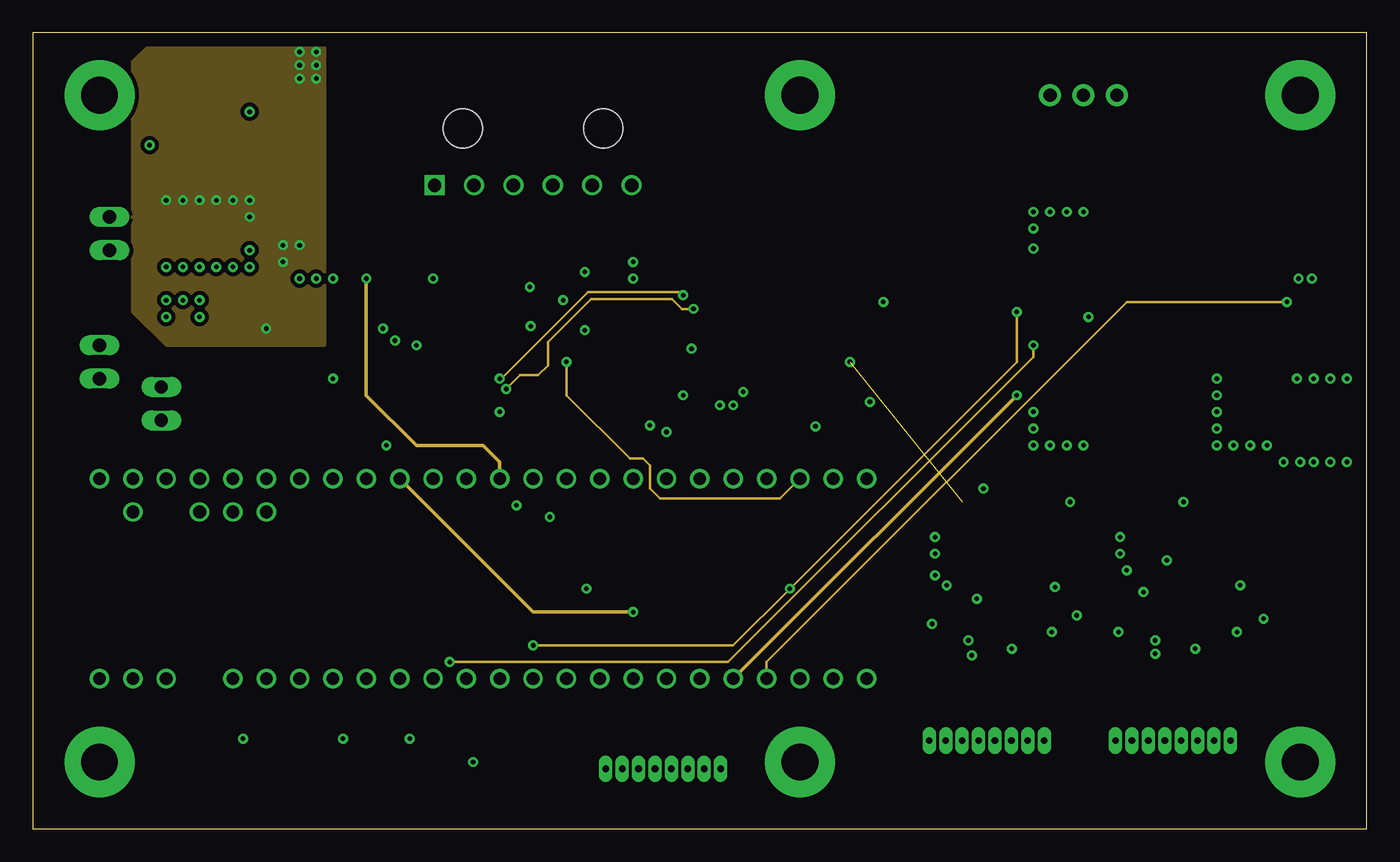
[diagram p6: board, inner layer Route15]
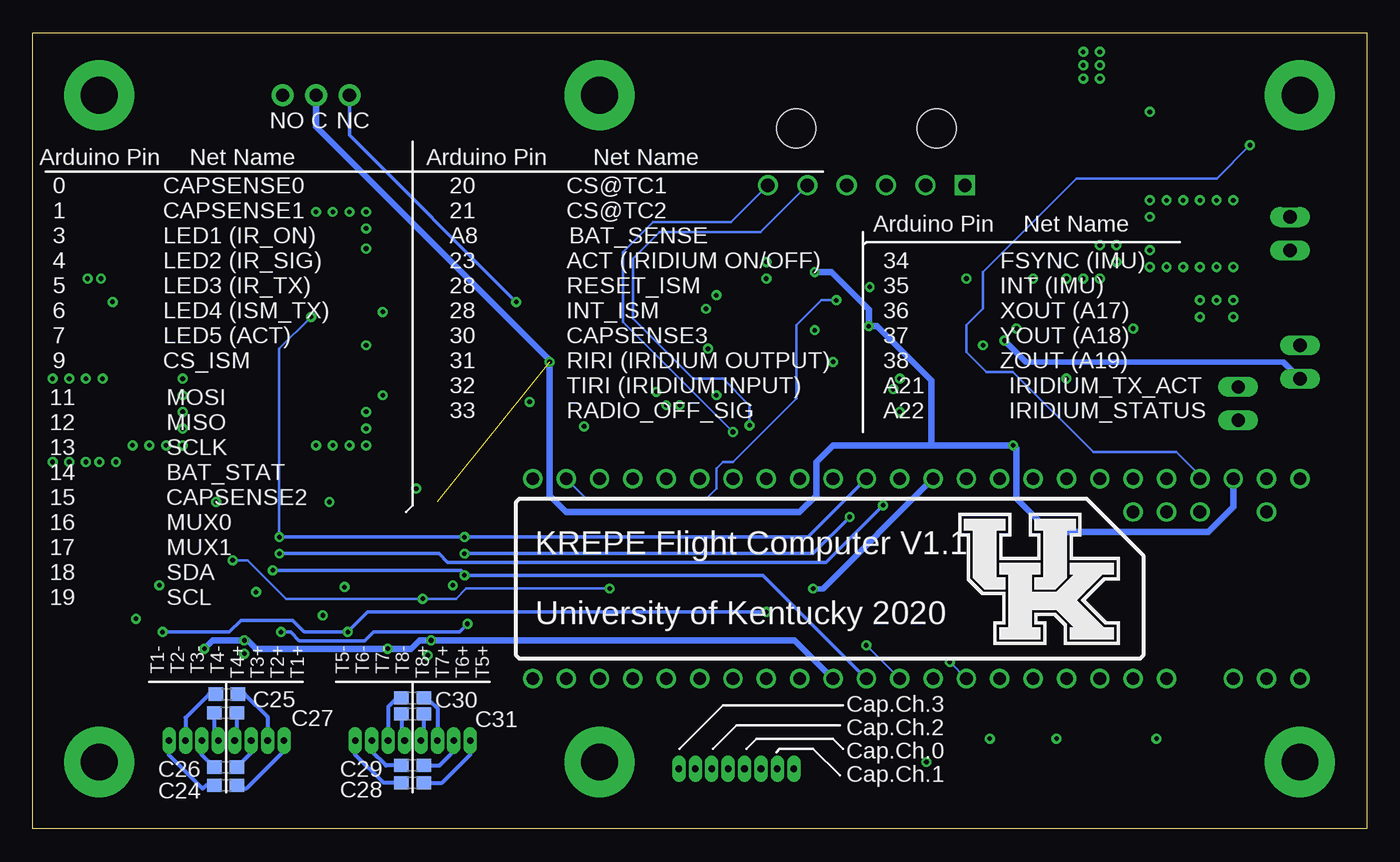
[diagram p7: board, bottom side, seen from below]

Size 101.58 x 60.63 mm. Coordinates in mm from the lower left corner, seen from the top.
Outline: 0,0 101.58,0 101.58,60.63 0,60.63 0,0
Copper layers (1+2*15+16): Top 0.035mm / dielectric 0.11mm / Route2 0.035mm / dielectric 1.13mm / Route15 0.035mm / dielectric 0.11mm / Bottom 0.035mm
Design rules "default *": minimum track width 6mil, minimum drill 0.35mm, track to track 6mil, track to pad 6mil, pad to pad 6mil, via to via 6mil, smd to smd 6mil, copper to edge 40mil, drill to drill 6mil, minimum pad ring 10mil, minimum via ring 8mil, stop-mask expansion 4mil, vias tented up to drill 14mil, thermal gap 10mil

### Footprints (pad centres in the part's own frame; a part is rotated, then mirrored left to right if it is on the bottom)
1X02 = drill 1.016 long: 1 -1.27,0; 2 1.27,0
CONN_R-SMT-1(10) = smd 0.838 x 0.889: 1 0,0 | smd 0.94 x 2.057: 2 -1.48,-1.505; 3 1.48,-1.505
JST_S2B-PH-SM4-TB(LF)(SN) = smd 1 x 3.5: 1 -1,0; 2 1,0 | smd 1.5 x 3.4: S1 -3.35,-5.75; S2 3.35,-5.75
C0603 = smd 1.1 x 1: 1 -0.85,0; 2 0.85,0
53048-0810 = drill 0.508 long: 1 -4.375,0; 2 -3.125,0; 3 -1.875,0; 4 -0.625,0; 5 0.625,0; 6 1.875,0; 7 3.125,0; 8 4.375,0
LED-0603 = smd 1 x 1: A -0.877,0; C 0.877,0
SOD123FL = smd 0.91 x 1.22: A 1.625,0; C -1.625,0
2,8-PAD = drill 2.8 pad 5.334: B2,8 0,0
TSSOP16 = smd 0.9 x 0.35: 1 -2.875,2.275; 2 -2.875,1.625; 3 -2.875,0.975; 4 -2.875,0.325; 5 -2.875,-0.325; 6 -2.875,-0.975; 7 -2.875,-1.625; 8 -2.875,-2.275; 9 2.875,-2.275; 10 2.875,-1.625; 11 2.875,-0.975; 12 2.875,-0.325; 13 2.875,0.325; 14 2.875,0.975; 15 2.875,1.625; 16 2.875,2.275
1X03-CLEANBIG = drill 1.016 pad 1.676: 1 -2.54,0; 2 0,0; 3 2.54,0
CHIP-LED0603 = smd 0.8 x 0.8: A 0,-0.75; C 0,0.75
R0603 = smd 1 x 1.1: 1 -0.85,0; 2 0.85,0
SOT23-5L = smd 0.55 x 1.2: 1 -0.95,-1.3; 2 0,-1.3; 3 0.95,-1.3; 4 0.95,1.3; 5 -0.95,1.3
MF05A = smd 1.27 x 0.559: 1 -1.219,0.953; 2 -1.219,0; 3 -1.219,-0.953; 4 1.219,-0.953; 5 1.219,0.953
MOD_COM-13909 = smd 3 x 1.2: 1 -7.5,7; 2 -7.5,5; 3 -7.5,3; 4 -7.5,1; 5 -7.5,-1; 6 -7.5,-3; 7 -7.5,-5; 8 -7.5,-7; 9 7.5,-7; 10 7.5,-5; 11 7.5,-3; 12 7.5,-1; 13 7.5,1; 14 7.5,3; 15 7.5,5; 16 7.5,7
LFCSP16_LQ = smd 0.8 x 0.25: 1 -1.5,0.75; 2 -1.5,0.25; 3 -1.5,-0.25; 4 -1.5,-0.75; 9 1.5,-0.75; 10 1.5,-0.25; 11 1.5,0.25; 12 1.5,0.75 | smd 0.25 x 0.8: 5 -0.75,-1.5; 6 -0.25,-1.5; 7 0.25,-1.5; 8 0.75,-1.5; 13 0.75,1.5; 14 0.25,1.5; 15 -0.25,1.5; 16 -0.75,1.5
QFN40P300X300X105-25N = smd 0.64 x 0.22: 1 -1.545,1; 2 -1.545,0.6; 3 -1.545,0.2; 4 -1.545,-0.2; 5 -1.545,-0.6; 6 -1.545,-1; 13 1.545,-1; 14 1.545,-0.6; 15 1.545,-0.2; 16 1.545,0.2; 17 1.545,0.6; 18 1.545,1 | smd 0.22 x 0.64: 7 -1,-1.545; 8 -0.6,-1.545; 9 -0.2,-1.545; 10 0.2,-1.545; 11 0.6,-1.545; 12 1,-1.545; 19 1,1.545; 20 0.6,1.545; 21 0.2,1.545; 22 -0.2,1.545; 23 -0.6,1.545; 24 -1,1.545 | smd 1.7 x 1.54: 25 0,0
DCU8 = smd 1.168 x 0.254: 1 -1.372,0.75; 2 -1.372,0.25; 3 -1.372,-0.25; 4 -1.372,-0.75; 5 1.372,-0.75; 6 1.372,-0.25; 7 1.372,0.25; 8 1.372,0.75
DRL6 = smd 1.092 x 0.203: 1 -0.66,0.5; 2 -0.66,0; 3 -0.66,-0.5; 4 0.66,-0.5; 5 0.66,0; 6 0.66,0.5
SOT23 = smd 1 x 1.4: 1 -0.95,-1.1; 2 0.95,-1.1; 3 0,1.1
SOP65P640X110-14N = smd 1.48 x 0.41: 1 -2.865,1.95; 2 -2.865,1.3; 3 -2.865,0.65; 4 -2.865,0; 5 -2.865,-0.65; 6 -2.865,-1.3; 7 -2.865,-1.95; 8 2.865,-1.95; 9 2.865,-1.3; 10 2.865,-0.65; 11 2.865,0; 12 2.865,0.65; 13 2.865,1.3; 14 2.865,1.95
TEENSY_3.5/3.6_BASIC = drill 0.965: 0/RX -25.4,-7.62; 1/TX -22.86,-7.62; 3/CANTX -17.78,-7.62; 3V3 7.62,-7.62; 3V3_LO -22.86,7.62; 4/CANRX -15.24,-7.62; 5 -12.7,-7.62; 6 -10.16,-7.62; 7 -7.62,-7.62; 8 -5.08,-7.62; 9/CS -2.54,-7.62; 10/CS 0,-7.62; 11/MOSI 2.54,-7.62; 12/MISO 5.08,-7.62; 13/SCK 5.08,7.62; 14/A0 2.54,7.62; 15/A1 0,7.62; 16/A2 -2.54,7.62; 17/A3 -5.08,7.62; 18/A4/SDA -7.62,7.62; 19/A5/SCL -10.16,7.62; 20/A6 -12.7,7.62; 21/A7 -15.24,7.62; 21/DAC0 12.7,7.62; 22/A8 -17.78,7.62; 23/A9 -20.32,7.62; 24 10.16,-7.62; 25 12.7,-7.62; 26 15.24,-7.62; 27 17.78,-7.62; 28 20.32,-7.62; 29 22.86,-7.62; 30 25.4,-7.62; 31/A12 27.94,-7.62; 32/A13 30.48,-7.62; 33/A14 30.48,7.62; 34/A15 27.94,7.62; 35/A16 25.4,7.62; 36/A17 22.86,7.62; 37/A18 20.32,7.62; 38/A19 17.78,7.62; 39/A20 15.24,7.62; A10 -17.78,5.08; A11 -15.24,5.08; A22/DAC1 10.16,7.62; AGND -25.4,7.62; AREF -20.32,5.08; GND -27.94,-7.62; GND2 7.62,7.62; VIN -27.94,7.62; VUSB -25.4,5.08
DIP6 = smd 1.9 x 1.5: 1 -4.15,2.54; 2 -4.15,0; 3 -4.15,-2.54; 4 4.15,-2.54; 5 4.15,0; 6 4.15,2.54
43650-0600 = drill 1.02 square: P$1 7.5,4.32 | drill 1.02: P$2 4.5,4.32; P$3 1.5,4.32; P$4 -1.5,4.32; P$5 -4.5,4.32; P$6 -7.5,4.32 | hole 3: 5.35,0; -5.35,0

### Placement (x,y rotation side)
ACTIVATION_SW  5.08,35.56 90 top
ANT  97.54,30.99 90 top
BATTERY  11.43,45.34 270 top
C1  15.24,45.34 270 top
C2  11.43,38.1 90 top
C3  79.63,14.1 90 top
C4  93.73,13.97 90 top
C5  85.34,24.89 0 top
C6  78.99,22.86 90 top
C8  60.2,32.77 270 top
C9  51.82,30.23 90 top
C10  53.34,30.23 90 top
C11  56.64,29.46 0 top
C14  11.43,54.61 0 top
C15  46.99,33.02 180 top
C16  51.94,38.1 90 top
C17  43.56,42.16 270 top
C18  29.21,39.37 270 top
C19  33.02,42.42 180 top
C20  33.15,36.7 180 top
C22  96.9,39.88 90 top
C24  86.89,3.31 180 bottom
C25  86.8,10.26 180 bottom
C26  86.9,4.7 180 bottom
C27  86.9,8.83 180 bottom
C28  72.66,3.51 180 bottom
C29  72.66,4.83 180 bottom
C30  72.66,9.96 180 bottom
C31  72.66,8.74 180 bottom
C32  71.63,24.89 0 top
C33  92.71,20.57 270 top
CAPSENSE  48.01,4.57 0 top
CHARGE  9.78,32.38 270 top
CHG  19.05,46.99 0 top
D3  15.24,34.29 0 top
H1  96.52,5.08 0 top
H2  58.42,5.08 0 top
H3  5.08,5.08 0 top
H4  58.42,55.88 0 top
H5  96.52,55.88 0 top
H6  5.08,55.88 0 top
IC1  86.87,12.7 0 top
IC3  72.9,12.7 0 top
ISM_SW  80.01,55.88 0 top
LED1  13.72,6.86 270 top
LED2  18.03,6.86 90 top
LED3  25.65,6.86 90 top
LED4  30.48,6.86 90 top
LED5  35.56,5.08 90 top
P1  86.83,6.73 0 top
P2  72.64,6.73 0 top
R1  22.86,46.23 90 top
R2  24.13,38.1 180 top
R3  11.43,57.15 180 top
R4  13.72,8.89 180 top
R5  20.32,34.29 0 top
R6  20.07,31.37 270 top
R7  17.91,31.37 90 top
R8  18.03,8.89 0 top
R9  25.65,8.64 0 top
R10  30.48,8.64 0 top
R11  35.56,6.86 0 top
R13  29.72,31.37 90 top
R14  52.07,41.15 0 top
R15  52.07,43.18 0 top
R18  63.75,30.48 90 top
U1  21.59,41.91 180 top
U2  33.02,39.37 0 top
U3  85.85,37.97 0 top
U4  57.15,33.02 0 top
U5  46.99,38.1 270 top
U6  33.02,33.02 180 top
U7  40.01,37.97 0 top
U8  40.01,41.91 0 top
U9  16.51,39.37 180 top
U12  73.66,21.08 180 top
U13  87.63,21.08 180 top
U$1  33.02,19.05 0 top
U$29  19.05,54.61 0 top
VBAT_PTH  5.84,45.34 90 top
X3  38.1,53.34 180 top

### Tracks (layer width: path | path; a pad name or v marks a point on that pad's centre or on a via)
1V8
  Top 0.203: 38.87,42.41 U8.1 | U5.13 45.99,34.29 | U5.22 50.8,38.3 | 38.75,40.39 U7.6 | 44.45,39.37 44.45,39.32 45.07,38.7 U5.8
  Top 0.254: C19.1 34.24,42.05 U2.5 34.3,40.39 | 45.99,34.29 45.99,33.17 | 45.99,33.17 C15.2 | 50.8,38.3 51.44,38.94 51.93,38.94 C16.2 51.98,38.99 53.21,38.99 | U6.2 36.33,32.77 36.34,32.77 | 45.59,32.77 45.99,33.17 | 37.67,42.41 38.1,42.41 | 38.1,42.41 U8.1 | 53.21,40.85 R14.2 | 38.1,42.41 38.1,43.18 39.37,44.45 46.99,44.45 48.26,43.18 48.26,41.91 47.12,40.77 45.21,40.77 44.45,40 44.45,39.37
  Top 0.305: 35.65,40.39 37.67,42.41
  Top 0.406: 34.3,40.39 35.65,40.39 37.08,40.39 | 37.08,40.39 37.08,32.77 | 36.34,32.77 37.08,32.77 | 37.08,32.77 45.59,32.77 | C15.2 47.41,31.75 49.53,31.75 50.8,33.02 50.8,34.29 53.21,36.7 53.21,38.99 53.21,40.85 | R14.2 R15.2 | 37.08,40.39 38.75,40.39
3V3  (via drill 0.35)  (1 unrouted)
  Top 0.203: U7.1 38.1,38.47 v37.91,38.29 | U8.6 v42.04,42.41 | R13.2 30.27,32.77 U6.7
  Top 0.254: U4.14 57.4,35.17 57.78,35.56 57.15,35.56 56.9,35.31 U4.15 | v85.47,14.35 85.47,14.32 IC1.2 | v88.52,13.72 88.56,13.68 IC1.14 93.17,13.68 C4.1 | C3.1 79.2,13.68 IC3.14
  Top 0.305: v26.92,29.21 27.94,30.23 27.94,31.75 28.41,32.22 R13.2 | IC3.2 71.22,14.32 v71.25,14.35 71.25,15.11 66.29,20.07 66.29,23.11 68.07,24.89 C32.1 70.87,24.8 70.87,23.1 U12.8 | IC3.14 74.59,13.68 v74.55,13.72 74.55,16.38 75.69,17.53 78.74,17.53 79.5,18.29 79.5,21.5 C6.1 | v88.52,13.72 88.52,15.37 90.17,17.02 91.95,17.02 93.73,18.8 93.73,20.83 93.13,21.42 C33.1 92.4,21.73 U13.5 | 57.78,35.56 60.2,35.56 | 60.2,35.56 v62.23,35.56 | C8.1 60.2,35.56 | C6.1 78.72,21.73 U12.5 | C6.1 79.41,22.01 82.3,24.89 C5.1 84.77,24.62 U13.8
  Bottom 0.508: U$1.3V3_LO 10.16,24.51 12.06,22.61 24.13,22.61 26.67,25.15 26.67,28.96 v26.92,29.21 33.15,29.21 | ISM_SW.2 80.01,53.47 62.23,35.69 v62.23,35.56 62.23,25.4 60.96,24.13 43.18,24.13 41.91,25.4 41.91,27.94 40.64,29.21 33.15,29.21 | v42.04,42.41 40.77,42.41 37.91,39.56 v37.91,38.29 37.28,38.29 33.15,34.16 33.15,29.21 | v88.52,13.72 87.88,14.35 v85.47,14.35 85.22,14.35 84.58,13.72 v74.55,13.72 72.77,13.72 72.14,14.35 v71.25,14.35 43.56,14.35 U$1.3V3
3V3_RADIO
  Top 0.406: U3.13 96.85,38.97 C22.1
  Top 0.508: ISM_SW.3 82.55,46.48 90.06,38.97 U3.13
ACT  (via drill 0.35)
  Top 0.254: v8.89,52.07 8.89,55.63 10.41,57.15 R3.2
  Bottom 0.203: v8.89,52.07 11.43,49.53 22.1,49.53 29.21,42.42 29.21,39.62 30.48,38.35 30.48,36.32 28.96,34.8 26.92,34.8 20.83,28.7 14.48,28.7 12.7,26.92 U$1.23/A9
BAT_SENSE
  Top 0.203: R6.2 R7.1 15.24,27.85 U$1.22/A8
BAT_STAT  (via drill 0.35)
  Top 0.254: U1.1 24.1,43.21 v25.4,41.91
  Top 0.508: U1.1 22.54,44.93 22.92,45.31 R1.1
  Route15 0.254: v25.4,41.91 25.4,33.02 29.21,29.21 34.29,29.21 35.56,27.94 U$1.14/A0
CAPSENSE0
  Top 0.406: CAPSENSE.4 47.38,6.47 45.97,7.87 44.45,7.87 42.16,10.16 37.08,10.16 36.83,10.41 36.83,12.45 34.04,15.24 11.43,15.24 U$1.0/RX
CAPSENSE1
  Top 0.406: U$1.1/TX 12.45,13.72 33.27,13.72 34.29,12.7 34.29,10.41 35.81,8.89 40.64,8.89 42.93,6.6 44.2,6.6 44.88,5.92 CAPSENSE.2
CAPSENSE2  (via drill 0.35)
  Top 0.406: v42.16,18.29 44.45,16 44.45,9.91 45.47,8.89 47.24,8.89 50.04,6.1 50.04,4.73 CAPSENSE.6
  Bottom 0.406: U$1.15/A1 41.4,18.29 v42.16,18.29
CAPSENSE3
  Top 0.406: CAPSENSE.8 52.38,6.92 54.61,9.14 56.64,9.14 58.42,10.92 U$1.30
CS@TC1  (via drill 0.35)
  Top 0.203: v82.8,20.95 81.79,21.97 81.79,22.61 82.3,23.11 83.06,23.11 83.79,22.38 U13.9
  Top 0.254: v36.83,24.64 21.72,24.64 20.32,26.04 U$1.20/A6
  Bottom 0.254: v82.8,20.95 70.65,20.95 70,20.3 41.17,20.3 v36.83,24.64
CS@TC2  (via drill 0.35)
  Top 0.203: v68.71,20.95 68.45,20.95 67.56,21.84 67.56,22.35 68.33,23.11 69.34,23.11 70.07,22.38 U12.9
  Top 0.254: v39.37,23.75 20.7,23.75 U$1.21/A7
  Bottom 0.254: v68.71,20.95 42.16,20.95 v39.37,23.75
CS_ISM  (via drill 0.35)
  Top 0.203: U3.5 76.34,36.97 v76.2,36.83
  Route15 0.203: v76.2,36.83 76.2,35.94 52.96,12.7 v31.75,12.7
  Bottom 0.203: v31.75,12.7 U$1.9/CS
FSYNC  (via drill 0.35)
  Top 0.203: U8.4 40.66,40.54 v40.39,40.26
  Bottom 0.203: v40.39,40.26 41.53,40.26 43.43,38.35 43.43,32.77 48.26,27.94 49.02,27.94 49.53,27.43 49.53,25.91 50.29,25.15 59.44,25.15 U$1.34/A15
GND  (via drill 0.35)
  Top 0.203: 39.32,41.88 U8.2 | U5.18 47.99,33.17 | U5.20 51.69,37.5 | U8.2 U8.5 | U7.2 U7.5 v42.04,37.97 | U5.9 44.75,38.3 43.81,39.24 43.81,40 v45.72,41.91 | U8.2 38.48,41.91 v37.85,41.27 | 43.75,42.86 C17.1 | R7.2 17.91,32.74 18.27,33.1 21.67,33.1 v22.86,34.29 | LED2.C 16.01,6.87 v16,6.86 LED1.C | R18.2 v63.75,32.51 | U12.1 77.13,19.13 v77.85,18.41 | U12.14 70.2,18.54 v69.6,18.54 | LED3.C v23.62,6.86 | LED4.C v28.7,6.86 | LED5.C v33.53,5.08
  Top 0.254: C19.2 31.66,41.91 v30.48,41.91 | U2.2 31.79,39.36 31.05,39.36 30.21,38.52 C18.2 | 47.99,33.17 C15.1 v49.53,33.02 | 51.69,37.5 C16.1 51.27,36.58 v50.16,36.58 | U6.1 35.04,32.27 v35.56,31.75 | C20.2 29.34,36.7 v29.21,36.83 | U4.2 v54.11,33.27 | v54.11,33.27 v54.1,33.27 | U4.3 54.61,32.77 v54.11,33.27 | U4.1 54.61,33.77 v54.11,33.27 | U4.6 56.9,30.74 56.9,30.73 56.98,30.65 57.28,30.65 | 57.28,30.65 57.4,30.77 U4.7 | v71.5,13.21 71.03,13.68 IC3.3 | IC3.15 79.01,14.32 C3.2 79.63,16.13 v79.5,16.26 | IC1.15 93.23,14.32 C4.2 v93.73,16 | U$29.2 C14.2 | C8.2 60.2,31.24 v59.6,30.65 | 57.28,30.65 59.44,30.65 | C9.2 51.82,31.75 v52.32,32.26 | C10.2 v53.34,32.26
  Top 0.305: U$29.2 v16.51,54.61 | IC1.3 85.13,13.68 v85.47,13.34 | 91.82,18.41 v91.95,18.54 | v91.95,18.54 92.71,19.3 C33.2 | 59.44,30.65 v59.6,30.65 | 57.4,30.77 57.4,29.56 C11.2 | C32.2 72.39,24.98 v72.39,25.91 | U13.14 84.77,18.22 v84.58,18.03 | C6.2 v78.99,24.89 | C5.2 v87.63,24.89 | U13.1 91.36,19.13 v91.95,18.54
  Top 0.406: v96.39,41.91 96.39,41.24 C22.2 97.41,41.24 v97.41,41.91
  Top 0.508: C1.2 15.09,44.34 BATTERY.2 11.16,44.07 | U1.2 v21.59,41.91 | v21.59,41.91 v20.32,41.91 | v21.59,41.91 v22.86,41.91 | R2.1 v26.67,38.1 | R5.2 v22.86,34.29 | C18.2 v29.21,36.83 | C17.1 45.55,43.01 v45.72,43.18 v45.72,41.91 | 93.31,33.02 U3.10
  Route2 0.203: v42.04,37.97 41.78,38.23
  other vias: 10.16,42.8 11.43,42.8 12.7,42.8 13.97,42.8 15.24,42.8 16.51,42.8 16.51,44.07 10.16,38.99 12.7,38.99 10.16,40.26 12.7,40.26 11.43,40.26 76.2,44.2 76.2,45.72 76.2,46.99 77.47,46.99 78.74,46.99 80.01,46.99 76.2,30.48 76.2,29.21 77.47,29.21 78.74,29.21 80.01,29.21 76.2,31.75 97.54,27.94 98.81,27.94 100.08,27.94 97.54,34.29 98.81,34.29 100.08,34.29 90.17,34.29 90.17,33.02 96.52,27.94 95.25,27.94 93.98,29.21 92.71,29.21 91.44,29.21 90.17,30.48 90.17,31.75 96.27,34.29 90.17,29.21
  pour Route2 (isolate 0.305): -1.27,63.5 113.03,63.5 113.03,-2.54 -1.27,-2.54
  pour Top: 8.89,45.09 17.27,45.09 17.27,42.42 9.14,42.42 8.89,42.67
  pour Top: 9.53,40.77 13.08,40.77 13.34,40.51 13.34,38.73 13.08,38.48 9.78,38.48 9.53,38.73
  pour Top: 76.2,44.07 80.01,44.07 80.01,46.99 76.2,46.99
  pour Top: 76.2,31.75 80.01,31.75 80.01,29.21 76.2,29.21
  pour Top: 89.66,28.7 93.6,28.7 94.87,27.43 101.6,27.43 101.6,34.8 89.66,34.8
ICM_FSYNC
  Top 0.203: U8.3 39.34,40.39 40.4,39.34 41.7,39.34 43.53,37.5 U5.11
ICM_INT
  Top 0.203: U5.12 41.04,37.1 U7.4
INT  (via drill 0.35)
  Top 0.203: U7.3 40.64,36.18 v40.64,35.56
  Route15 0.203: v40.64,35.56 40.64,33.02 45.47,28.19 46.48,28.19 46.99,27.69 46.99,25.91 47.75,25.15 56.9,25.15 U$1.35/A16
INT_ISM  (via drill 0.35)
  Top 0.203: U3.14 94.66,40.97 v95.5,40.13
  Route15 0.203: v95.5,40.13 83.31,40.13 55.88,12.7 U$1.29
IRIDIUM_STATUS  (via drill 0.35)
  Top 0.203: U$1.A22/DAC1 46.99,30.48 v46.99,30.73
  Bottom 0.203: X3.P$5 46.15,45.47 53.85,45.47 55.88,43.43 55.88,38.86 51.31,34.29 49.02,34.29 46.99,32.26 v46.99,30.73
IRIDIUM_TX_ACT  (via drill 0.35)
  Top 0.203: U$1.21/DAC0 45.72,27.69 v48.26,30.23
  Bottom 0.203: X3.P$6 48.39,46.23 54.36,46.23 56.64,43.94 56.64,38.61 v48.26,30.23
LED1
  Top 0.203: U$1.3/CANTX 15.24,9.56 R4.1
LED2
  Top 0.203: U$1.4/CANRX 17.78,9.49 R8.1
LED3
  Top 0.203: U$1.5 20.32,10.92 22.61,8.64 R9.1
LED4
  Top 0.203: R10.1 29.63,8.72 28.7,9.65 24.64,9.65 U$1.6
LED5
  Top 0.203: U$1.7 26.57,10.26 28.59,10.26 28.7,10.16 32.51,10.16 34.71,7.96 R11.1
MISO  (via drill 0.35)
  Top 0.203: U3.2 77.26,42.97 73.66,39.37 73.66,22.35 72.39,21.08 U12.11 70.15,21.08 69.8,20.73 69.8,20.17 69.27,19.63 | v83.31,19.68 83.57,19.94 83.57,20.83 83.82,21.08 U13.11
  Top 0.254: 69.32,19.68 69.27,19.63 68.94,19.3 v68.71,19.3
  Bottom 0.254: v68.71,19.3 68.58,19.3 | 68.58,19.3 45.97,19.3 U$1.12/MISO | v83.31,19.68 68.96,19.68 68.58,19.3
MOSI  (via drill 0.35)
  Top 0.203: U3.3 76.53,40.97 v74.93,39.37 | U12.12 71.77,20.43 72.14,20.07 72.14,17.78 v71.88,17.53 | U13.12 84.78,20.45 v86.36,20.45
  Route15 0.203: v74.93,39.37 74.93,35.56 v57.66,18.29 53.34,13.97 v38.1,13.97
  Route15 0.305: v57.66,18.29
  Bottom 0.203: v38.1,13.97 U$1.11/MOSI | v57.66,18.29 68.58,18.29 69.34,17.53 v71.88,17.53 82.3,17.53 85.22,20.45 v86.36,20.45
MUX0  (via drill 0.35)
  Top 0.254: IC3.1 69.39,15.61 v68.48,15.61 67.72,14.85 67.72,13.83 63.54,9.65 61.05,9.65 59.69,11.01 59.69,13.38 47.64,25.42 31.73,25.42 U$1.16/A2 | IC1.1 82.7,14.97 v82.68,14.99
  Bottom 0.254: v82.68,14.99 81.96,14.99 81.3,14.32 76.31,14.32 75.62,15.01 69.08,15.01 v68.48,15.61
MUX1  (via drill 0.35)
  Top 0.254: IC1.16 89.75,14.99 v91.69,14.99 | v77.6,14.98 77.59,14.97 IC3.16
  Route15 0.254: v45.72,16.51 38.1,16.51 U$1.17/A3
  Bottom 0.254: v91.69,14.99 86.61,14.99 85.72,15.88 81.79,15.88 80.9,14.98 v77.6,14.98 76.07,16.51 v45.72,16.51
N$3
  Top 0.203: U3.9 97.52,30.97 ANT.1
N$4
  Top 0.508: U1.5 22.54,38.84 R2.2
N$6
  Top 0.254: U$29.1 R3.1 10.58,55.45 C14.1
N$7
  cutout Route2: 101.6,33.15 101.6,29.34 97.16,29.34 97.16,33.02
N$9
  Top 0.254: R1.2 CHG.C
N$12
  Top 0.305: U2.4 34.24,36.95 C20.1
N$13
  Top 0.203: U6.8 29.9,30.52 R13.1
N$15
  Top 0.203: 44.32,37.9 U5.10 | 43.6,41.78 C17.2
  Top 0.254: C17.2 43.31,41.06 43.31,38.92 44.32,37.9
N$16
  cutout Top: 97.79,29.84 101.6,29.84 101.6,32.13 97.79,32.13
N$18  (via drill 0.35)
  Top 0.203: U5.23 49.41,38.7 | U6.3 34.51,33.39 35.08,33.39 35.19,33.5 v36.05,33.5
  Top 0.254: 49.41,38.7 v50.31,39.6 51.22,40.51 R14.1
  Route15 0.203: v36.05,33.5 37.1,34.55 38.49,34.55 39.24,35.3 39.24,37.09 42.52,40.37 48.66,40.37 49.42,39.6 v50.31,39.6
N$19  (via drill 0.35)
  Top 0.203: U5.24 49.13,39.1 49.4,39.37 | U6.4 34.91,34.29 v35.56,34.29
  Top 0.254: 49.4,39.37 49.53,39.5 v49.53,40.64 49.53,43.05 49.66,43.18 R15.1
  Route15 0.203: v35.56,34.29 35.69,34.29 42.29,40.89 49.28,40.89 v49.53,40.64
N$20
  Top 0.203: R4.2 12.87,6.96 LED1.A
N$21
  Top 0.203: 19.3,8.47 R8.2 18.88,6.96 LED2.A
N$22
  Top 0.203: 26.91,8.23 R9.2 26.5,6.96 LED3.A
N$23
  Top 0.203: R10.2 31.23,8.54 LED4.A
N$28
  Top 0.203: R11.2 36.31,6.76 LED5.A
POW_IN
  Top 0.508: ACTIVATION_SW.2 5.5,37.25 C2.1 | C2.1 13.12,37.25 15.56,39.69 U9.2 | C2.1 13.62,35.06 D3.C
RADIO_OFF_SIG  (via drill 0.35)
  Top 0.203: U$1.33/A14 63.5,29.38 R18.1
  Top 0.254: v64.77,40.13 64.77,27.94 U$1.33/A14
  Bottom 0.254: ISM_SW.1 77.47,52.83 v64.77,40.13
RESET_ISM  (via drill 0.35)
  Top 0.254: U3.6 76.88,34.97 v74.93,33.02
  Route15 0.254: v74.93,33.02 U$1.28
RIRI
  Top 0.203: U$1.31/A12 60.96,19.81 68.58,27.43 68.58,39.37 57.78,50.16 40.74,50.16 X3.P$4
SCL
  Top 0.254: U$1.19/A5/SCL 22.86,28.45 27.68,33.27 U6.6
SCLK  (via drill 0.35)
  Top 0.203: U3.4 80.38,38.97 v80.39,38.99 | v68.71,22.23 69.22,22.23 69.71,21.73 U12.10 | v82.8,22.23 82.93,22.23 83.44,21.72 84.75,21.72 U13.10
  Bottom 0.203: v80.39,38.99 82.8,36.58 v82.8,22.23
  Bottom 0.254: U$1.13/SCK 42.55,22.23 v68.71,22.23 v82.8,22.23
SDA
  Top 0.254: U6.5 27.42,33.77 21.59,27.94 21.59,26.04 22.35,25.27 24.13,25.27 25.4,26.54 U$1.18/A4/SDA
TIRI
  Top 0.203: U$1.32/A13 63.5,21.08 69.22,26.8 69.22,39.75 58.24,50.72 38.3,50.72 X3.P$3
TM_K1
  Top 0.305: P1.8 91.2,7.79 93.16,9.75 93.16,11.25 91.39,13.03 IC1.13
  Bottom 0.305: C24.2 88.39,3.31 88.65,3.05 91.2,5.6 P1.8
TM_K2
  Top 0.305: P1.7 89.95,7.44 92.45,9.94 92.45,11.06 91.14,12.38 IC1.12
  Bottom 0.305: C25.2 88.16,10.26 89.95,8.46 P1.7
TM_K3
  Top 0.305: IC1.11 90.89,11.72 91.74,10.87 91.74,10.13 90.71,9.1 89.87,9.1 88.7,7.93 P1.6
  Bottom 0.305: C26.2 88.7,5.65 P1.6
TM_K4
  Top 0.305: IC1.10 90.53,11.07 90.93,10.67 90.93,10.16 90.55,9.78 89.03,9.78 87.38,8.13 87.38,6.8 P1.5
  Bottom 0.305: C27.2 87.75,7.03 P1.5
TM_K5
  Top 0.305: IC3.13 76.89,13.03 78.23,11.68 78.23,8.96 77.02,7.75 P2.8
  Bottom 0.305: C28.2 74.88,3.51 77.02,5.64 P2.8
TM_K6
  Top 0.305: IC3.12 76.78,12.38 77.72,11.43 77.72,9.4 76.96,8.64 76.2,8.64 75.77,8.21 P2.7
  Bottom 0.305: C29.2 74.68,4.83 75.77,5.92 P2.7
TM_K7
  Top 0.305: P2.6 74.52,8.73 74.93,9.14 76.71,9.14 77.22,9.65 77.22,11.18 76.67,11.72 IC3.11
  Bottom 0.305: C30.2 73.57,9.91 73.91,9.91 74.52,9.3 P2.6
TM_K8
  Top 0.305: IC3.10 76.56,11.07 76.71,10.92 76.71,9.91 76.45,9.65 74.68,9.65 73.27,8.24 P2.5
  Bottom 0.305: C31.2 73.51,6.98 P2.5
TM_MUX1
  Top 0.203: U13.2 90.53,19.81 91.57,19.81 91.69,19.94 91.69,20.32 91.57,20.45 90.51,20.45 U13.3
  Top 0.254: 89.75,10.41 IC1.9 88.64,10.43 87.38,11.68 87.38,18.8 89.01,20.43 U13.3
TM_MUX2
  Top 0.203: U12.2 76.56,19.81 77.72,19.81 77.85,19.94 77.85,20.32 77.74,20.43 U12.3
  Top 0.254: IC3.9 74.28,10.43 73.41,11.3 73.41,18.54 75.26,20.39 76.49,20.39 U12.3
TP_K1
  Top 0.305: IC1.4 82.88,13.03 81.15,11.3 81.15,9.27 82.45,7.97 P1.1
  Bottom 0.305: P1.1 82.45,5.94 85.34,3.05 85.78,3.05 C24.1
TP_K2
  Top 0.305: IC1.5 82.99,12.38 81.79,11.18 81.79,9.65 83.7,7.74 P1.2
  Bottom 0.305: C25.1 85.44,10.26 83.7,8.52 P1.2
TP_K3
  Top 0.305: IC1.6 83.35,11.72 82.55,10.92 82.55,9.65 83.06,9.14 84.33,9.14 84.95,8.52 P1.3
  Bottom 0.305: C26.1 84.95,5.79 P1.3
TP_K4
  Top 0.305: IC1.7 83.47,11.07 83.06,10.67 83.06,9.91 83.31,9.65 85.6,9.65 86.2,9.05 P1.4
  Bottom 0.305: C27.1 86.05,6.88 P1.4
TP_K5
  Top 0.305: IC3.4 69.16,13.03 67.49,11.35 67.49,9.21 68.27,8.43 P2.1
  Bottom 0.305: C28.1 70.4,3.51 68.27,5.64 P2.1
TP_K6
  Top 0.305: IC3.5 69.27,12.38 68.07,11.18 68.07,9.4 69.52,7.95 P2.2
  Bottom 0.305: C29.1 70.61,4.83 69.52,5.92 P2.2
TP_K7
  Top 0.254: IC3.6 70.01,11.72
  Top 0.305: IC3.6 69.38,11.72 68.58,10.92 68.58,9.91 69.6,8.89 70.1,8.89 70.77,8.22 P2.3
  Bottom 0.305: C30.1 71.65,9.8 71.39,9.8 70.77,9.18 P2.3
TP_K8
  Top 0.305: P2.4 72.02,8.24 70.61,9.65 69.6,9.65 69.09,10.16 69.09,10.67 69.5,11.07 IC3.7
  Bottom 0.305: C31.1 71.81,6.94 P2.4
TP_MUX1
  Top 0.254: IC1.8 85.47,10.43 86.74,11.7 86.74,19.18 88.65,21.08 U13.4
TP_MUX2
  Top 0.254: IC3.8 71.89,10.43 72.77,11.3 72.77,18.67 75.18,21.08 U12.4
V+_IRIDIUM
  Top 1.905: U$29.4 27.55,52.07 X3.P$1
VBAT  (via drill 0.35)
  Top 0.508: BATTERY.1 15.09,46.34 C1.1 v15.24,47.88 | U1.3 20.64,44.13 v20.32,44.45 | v17.78,38.1 17.61,38.27 U9.3
  Top 1.27: VBAT_PTH.2 11.16,46.61 BATTERY.1
  other vias: 16.51,47.88 16.51,46.61 13.97,47.88 12.7,47.88 11.43,47.88 10.16,47.88 19.05,44.45 19.05,43.18 21.59,59.18 21.59,58.17 20.32,57.15 20.32,58.17 20.32,59.18 21.59,57.15
  pour Route15 (isolate 0.305): 22.23,59.69 22.23,36.83 10.16,36.83 7.62,39.37 7.62,58.42 8.89,59.69
  pour Top: 8.89,45.85 17.27,45.85 17.27,48.51 9.02,48.51 8.89,48.39
  pour Top: 18.41,45.09 20.83,45.09 20.83,42.8 18.41,42.8
  pour Top: 19.81,59.69 24,59.69 24,56.52 23.88,56.39 19.81,56.39
VIN  (via drill 0.35)
  Top 0.203: v27.58,37.19 22.61,32.22 R6.1
  Top 0.254: U2.3 32.58,38.42 33.02,38.86 33.02,39.75 32.45,40.32 U2.1 29.31,40.32 C18.1 28.7,40.22 27.58,39.1 v27.58,37.19
  Top 0.508: ACTIVATION_SW.1 U$1.VIN
  Bottom 0.406: ACTIVATION_SW.1 6.35,35.56 25.95,35.56 v27.58,37.19
VUSB
  Top 0.254: CHG.A 17.91,46.72 17.91,40.61
  Top 0.508: U9.1 17.6,40.61 17.91,40.61 U1.4 20.64,36.73 19.47,35.56 R5.1 D3.A 13.45,30.87 10.02,30.87 CHARGE.2 9.78,29.08 9.02,28.32 9.02,25.53 U$1.VUSB
XOUT
  Top 0.254: U4.5 56.4,30.75 55.79,30.14 C11.1 55.79,26.76 U$1.36/A17
YOUT
  Top 0.254: U4.4 55.02,32.27 54.23,31.48 54.23,30.1 54.23,29.21 | U$1.37/A18 54.1,27.43 54.23,27.56 54.23,29.21 | C10.1 54.06,29.38 54.23,29.21
ZOUT
  Top 0.254: U4.16 56.4,35.04 56.15,35.29 | 54.34,35.29 50.8,31.75 50.8,29.21 | 50.8,29.21 U$1.38/A19 | C9.1 51.65,29.21 50.8,29.21
  Top 0.305: 56.15,35.29 54.34,35.29

### Text on the board
tNames: Iridium | NC | C | NO | +Z | RFM69 | + | + | - | TX | RX | ST | ACT | +Y | - | +X | - | + | 5v only | IR_ON | IR_SIG | IR_TX | ACT | Thermocouples | ISM_TX
bNames: NC | C | NO | Net Name | Arduino Pin | Net Name | Arduino Pin | Net Name | Arduino Pin | 0 CAPSENSE0 / 1 CAPSENSE1 / 3 LED1 (IR_ON) / 4 LED2 (IR_SIG) / 5 LED3 (IR_TX) / 6 LED4 (ISM_TX) / 7 LED5 (ACT) / 9 CS_ISM | 34 FSYNC (IMU) / 35 INT (IMU) / 36 XOUT (A17) / 37 YOUT (A18) / 38 ZOUT (A19) / A21 IRIDIUM_TX_ACT / A22 IRIDIUM_STATUS | 20 CS@TC1 / 21 CS@TC2 / A8 BAT_SENSE / 23 ACT (IRIDIUM ON/OFF) / 28 RESET_ISM / 28 INT_ISM / 30 CAPSENSE3 / 31 RIRI (IRIDIUM OUTPUT) / 32 TIRI (IRIDIUM INPUT) / 33 RADIO_OFF_SIG | 11 MOSI / 12 MISO / 13 SCLK / 14 BAT_STAT / 15 CAPSENSE2 / 16 MUX0 / 17 MUX1 / 18 SDA / 19 SCL | KREPE Flight Computer V1.1 / / University of Kentucky 2020 | T5- / T6- / T7- / T8- / T8+ / T7+ / T6+ / T5+ | T1- / T2- / T3- / T4- / T4+ / T3+ / T2+ / T1+ | Cap.Ch.3 | Cap.Ch.2 | Cap.Ch.0 | Cap.Ch.1